# EAGLE board Printplaat version 2 with booting problems (EAGLE 9.7.0)
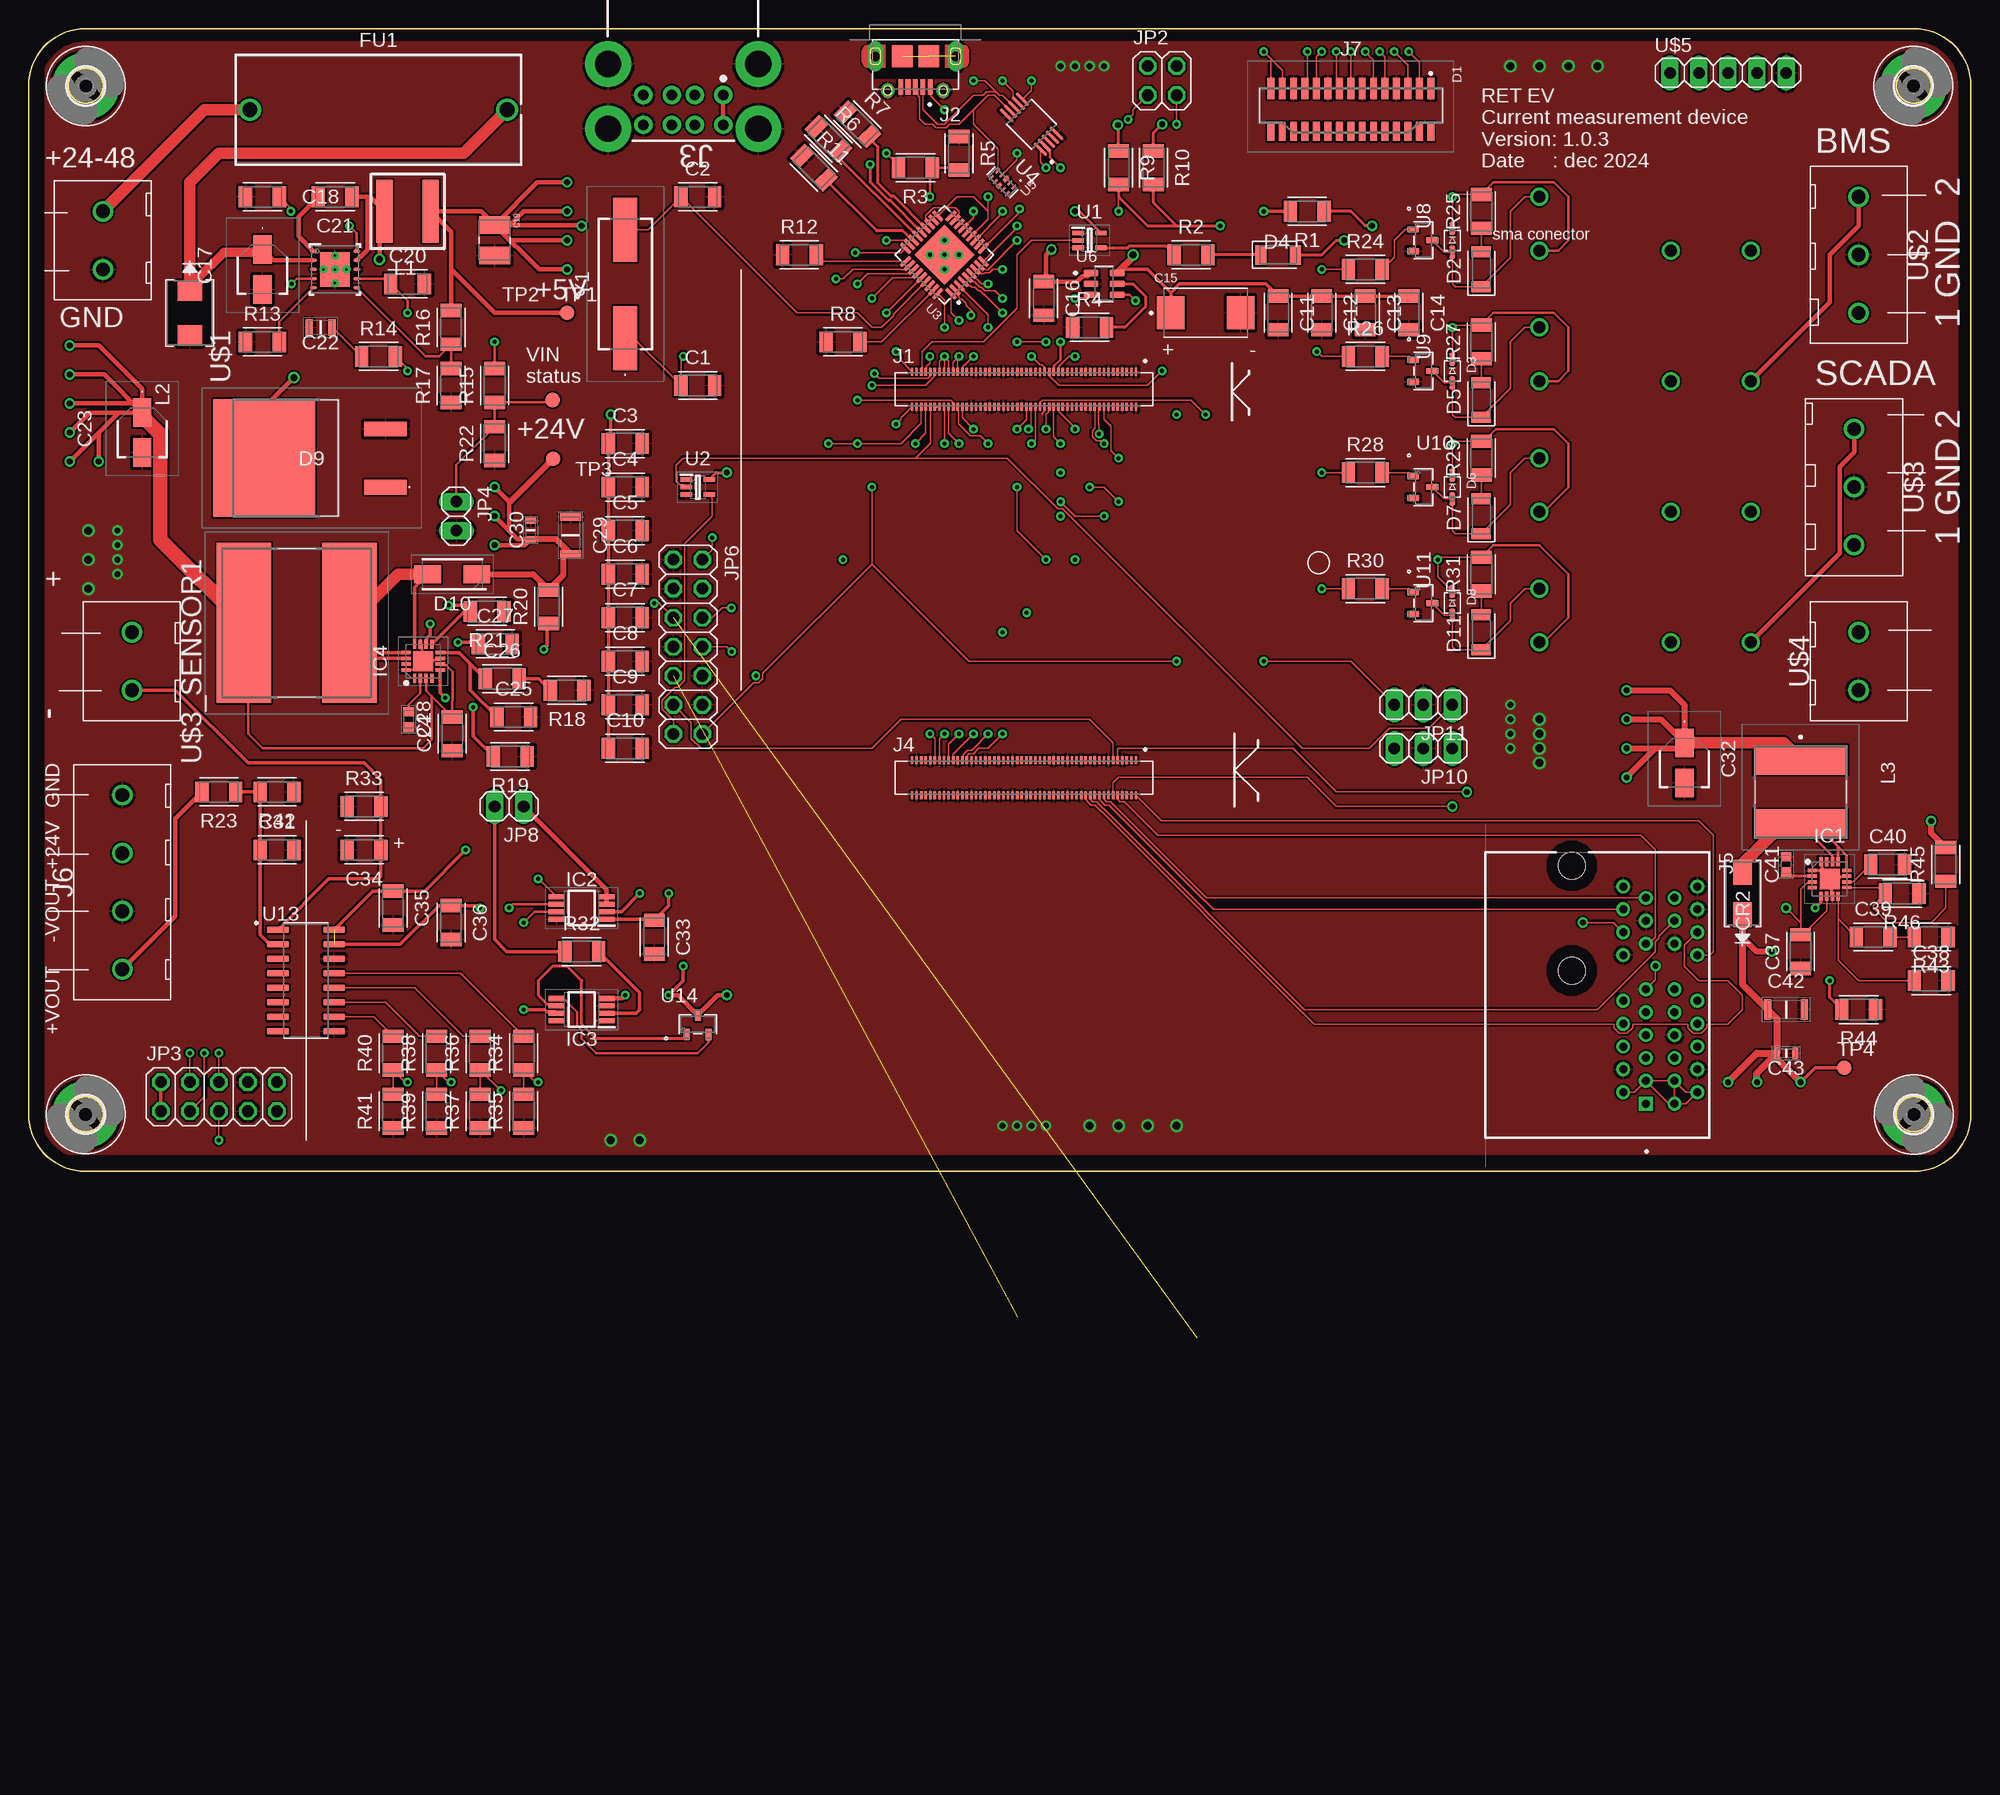
[diagram p7: board, top side]
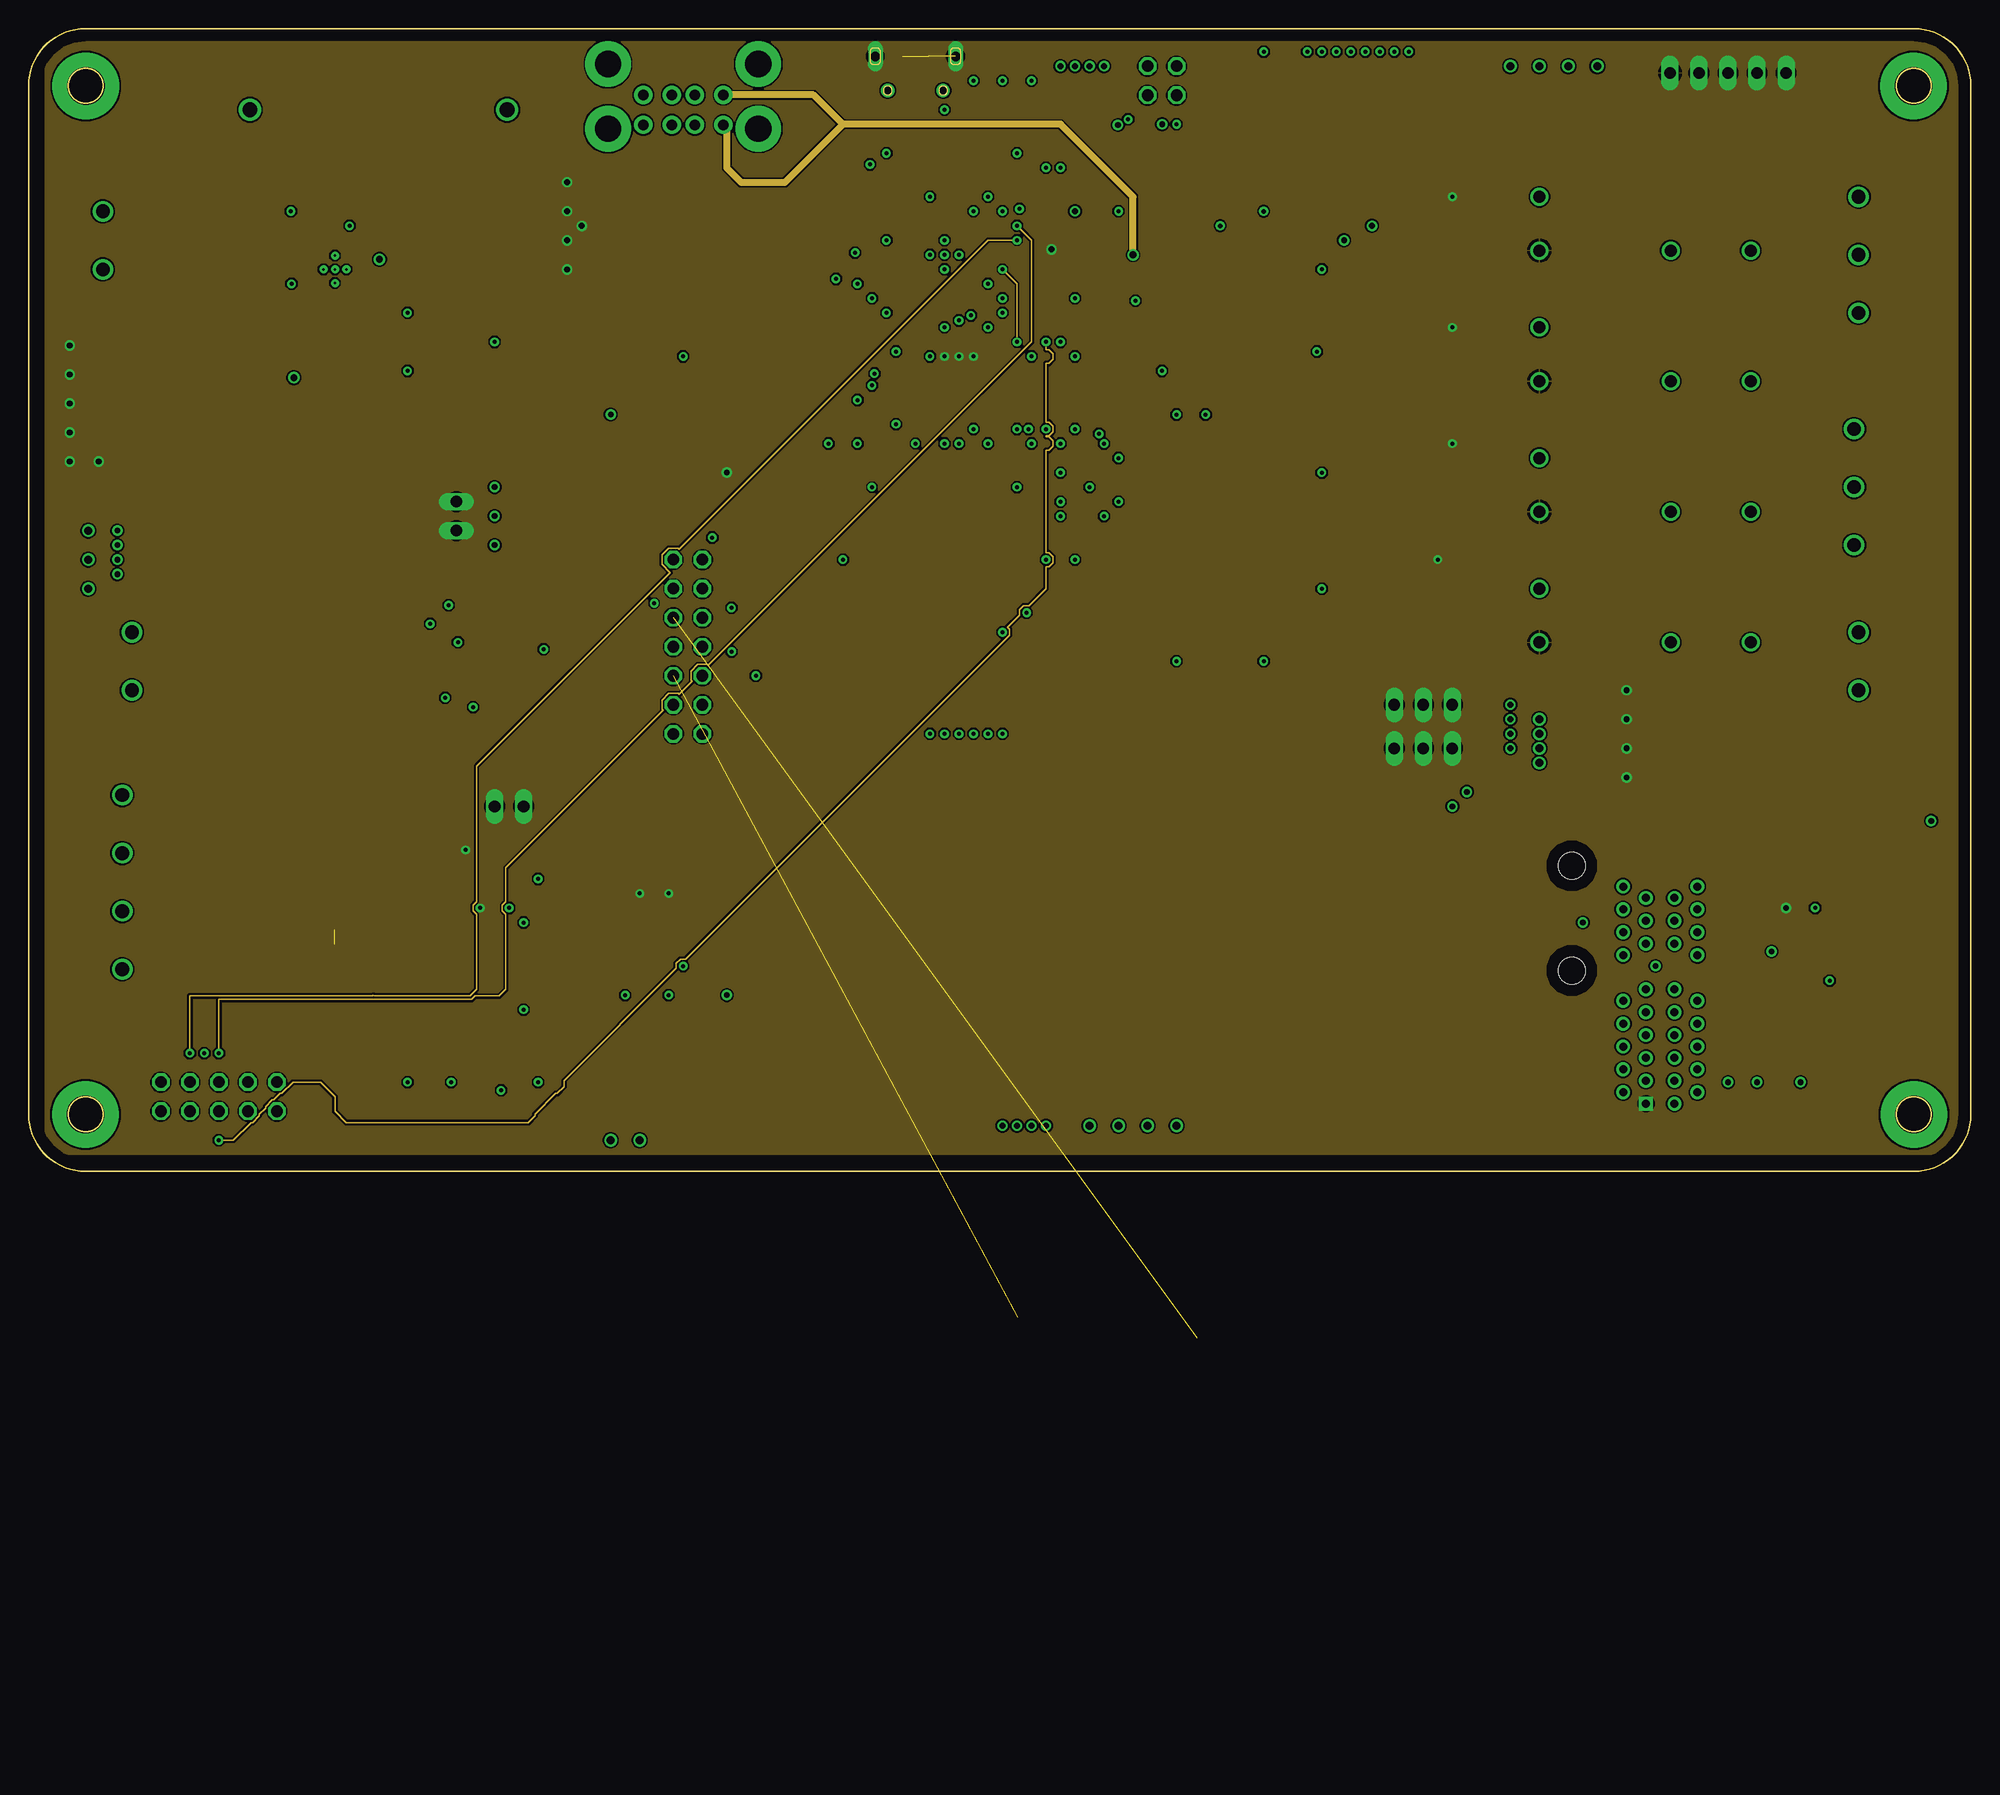
[diagram p8: board, inner layer Route2]
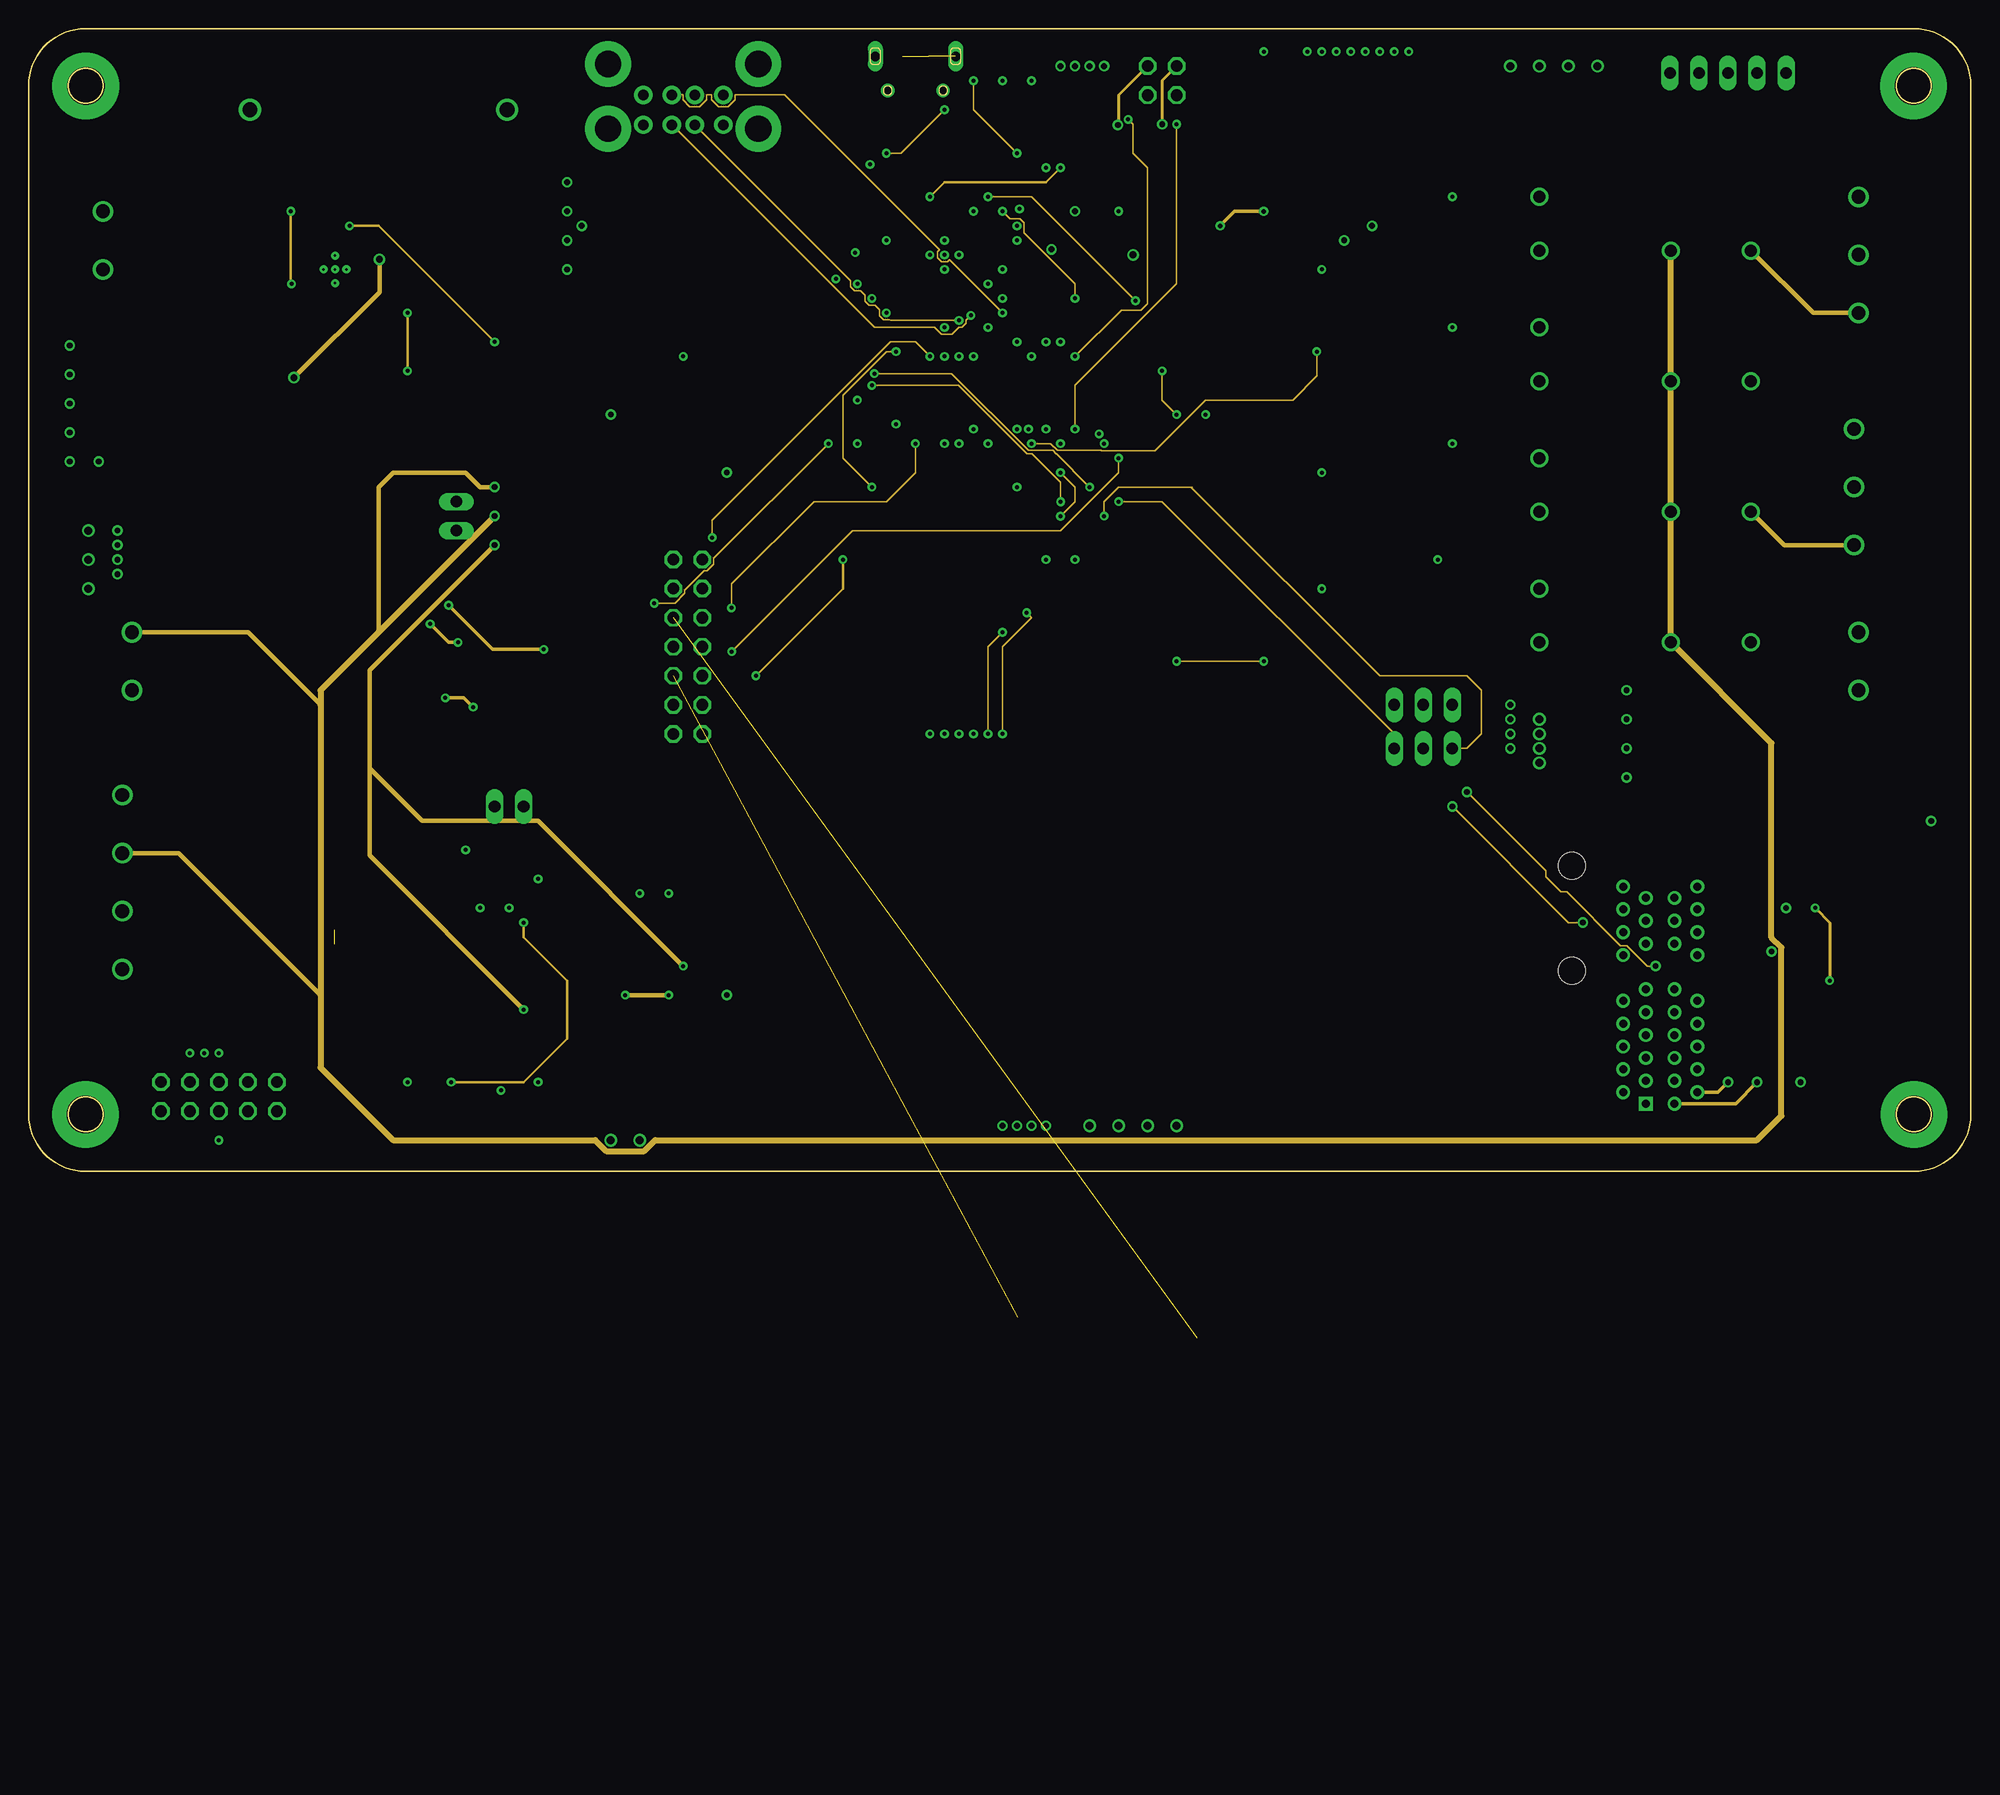
[diagram p9: board, inner layer Route3]
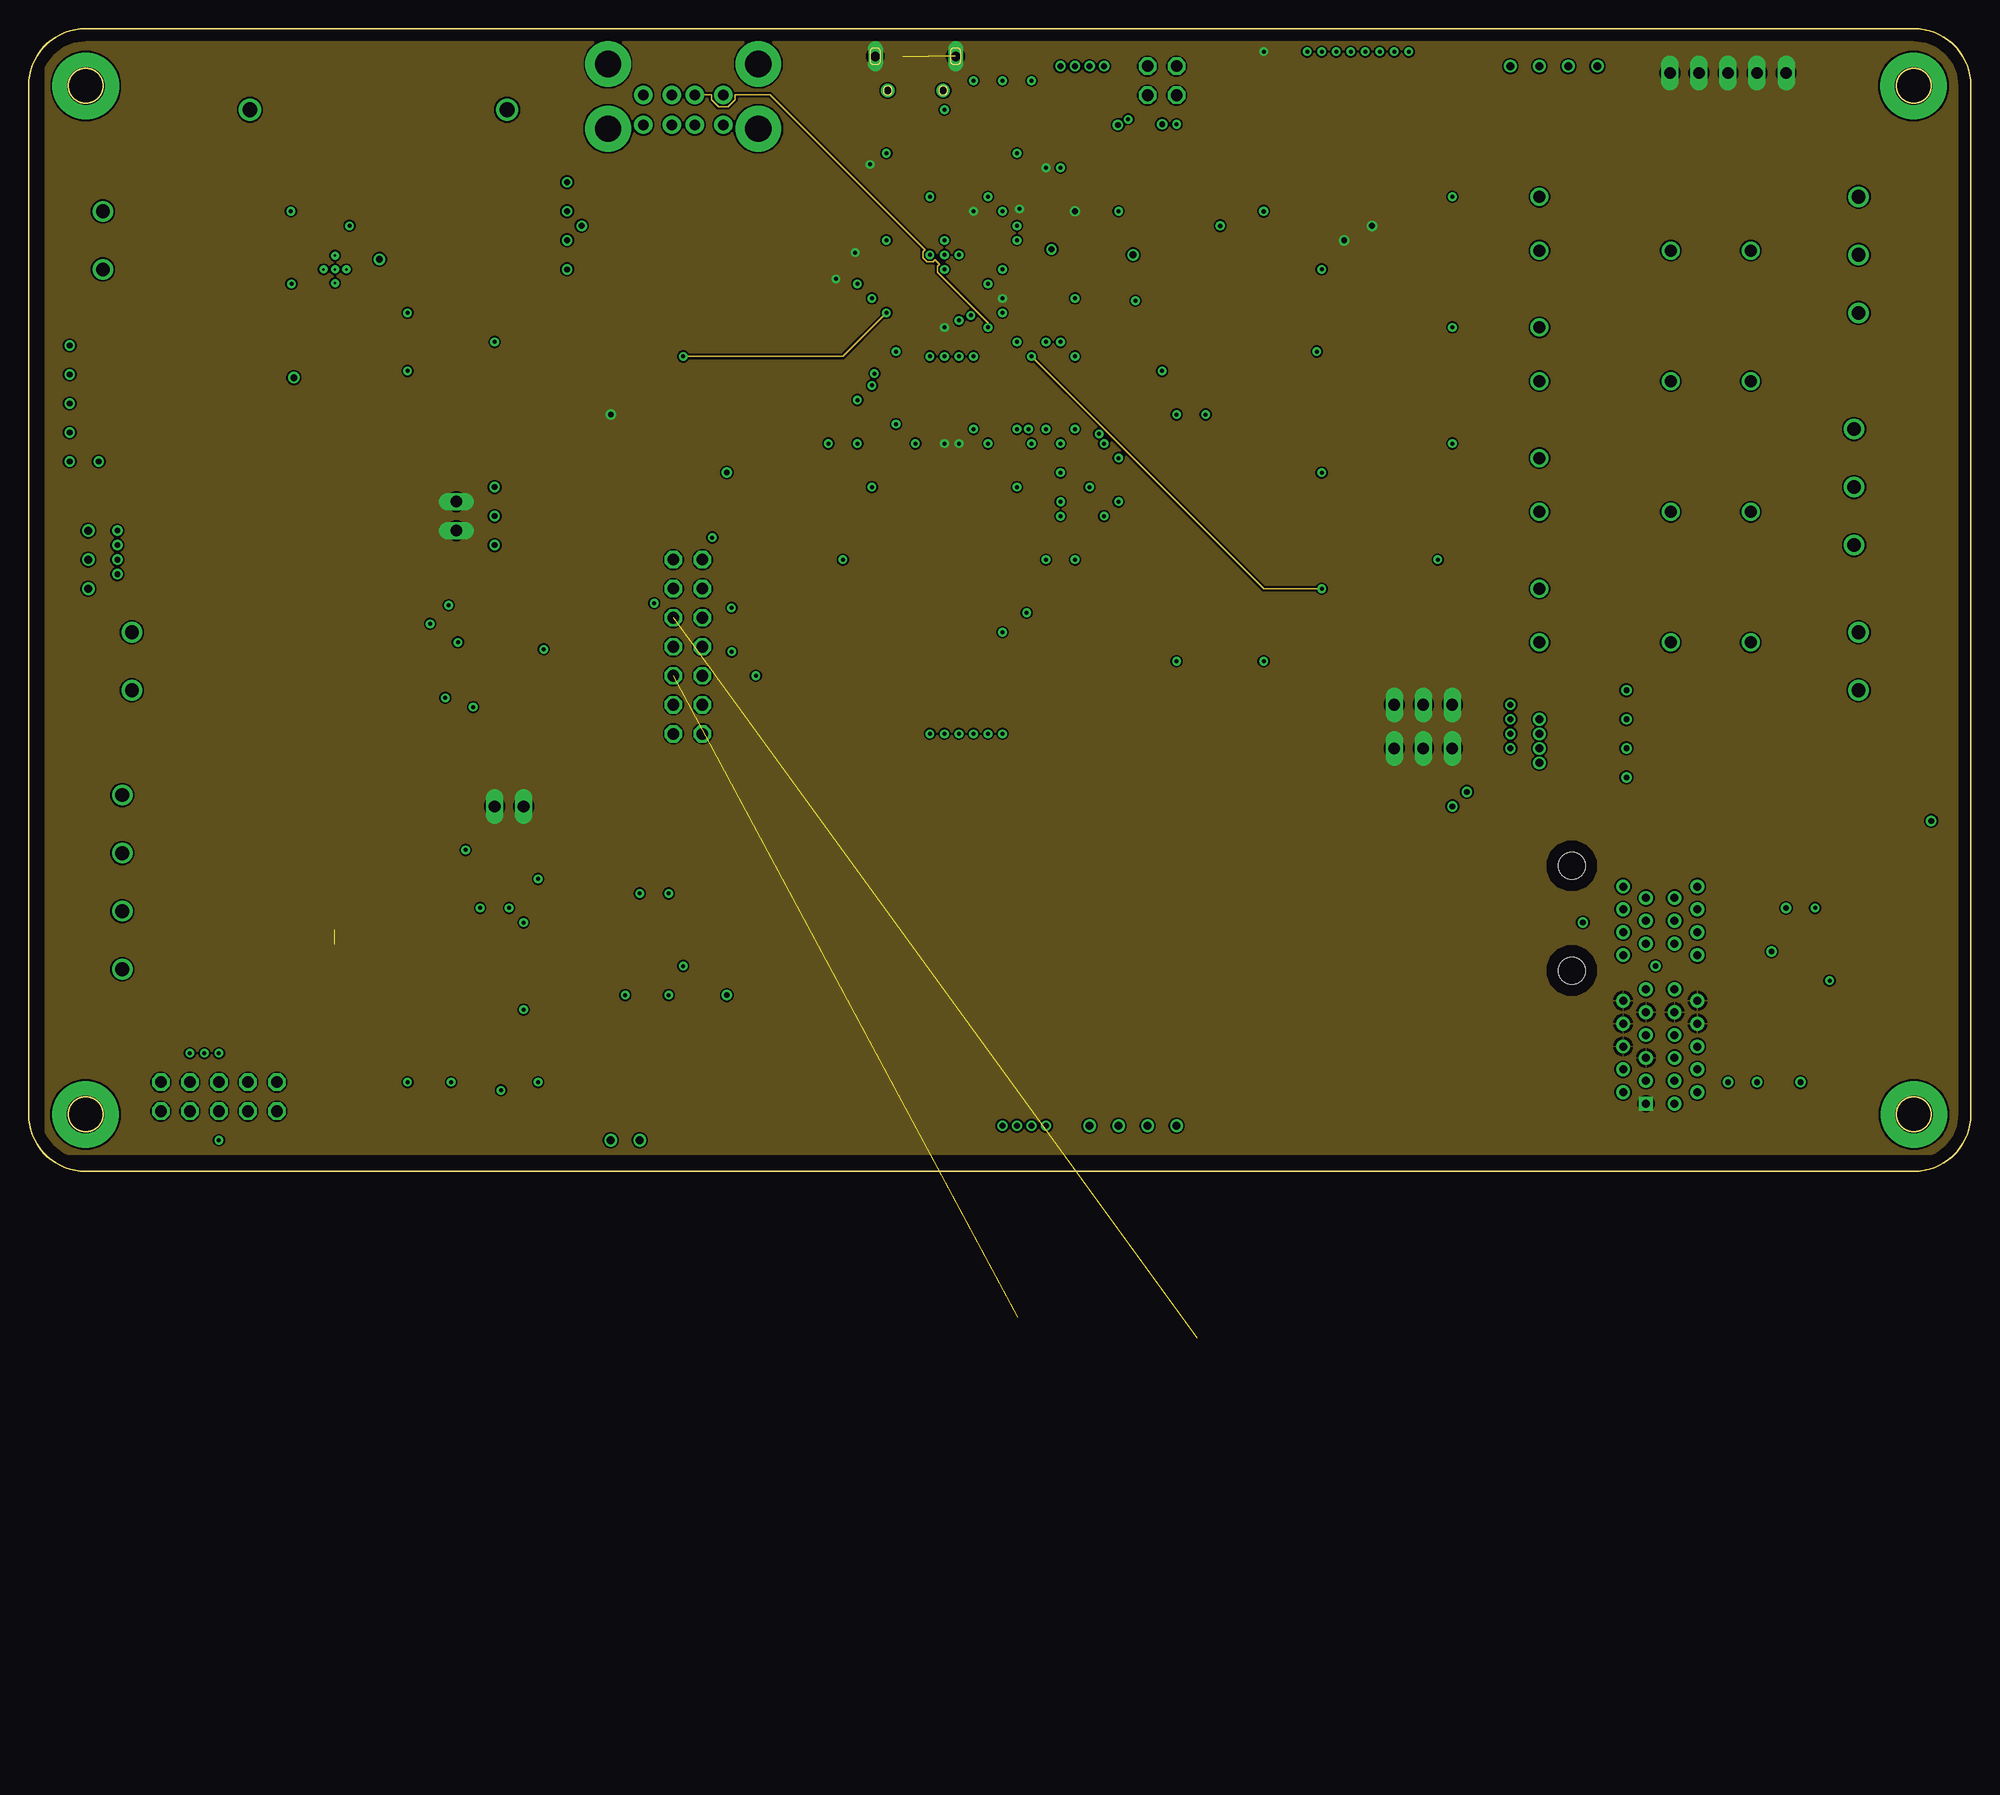
[diagram p10: board, inner layer Route4]
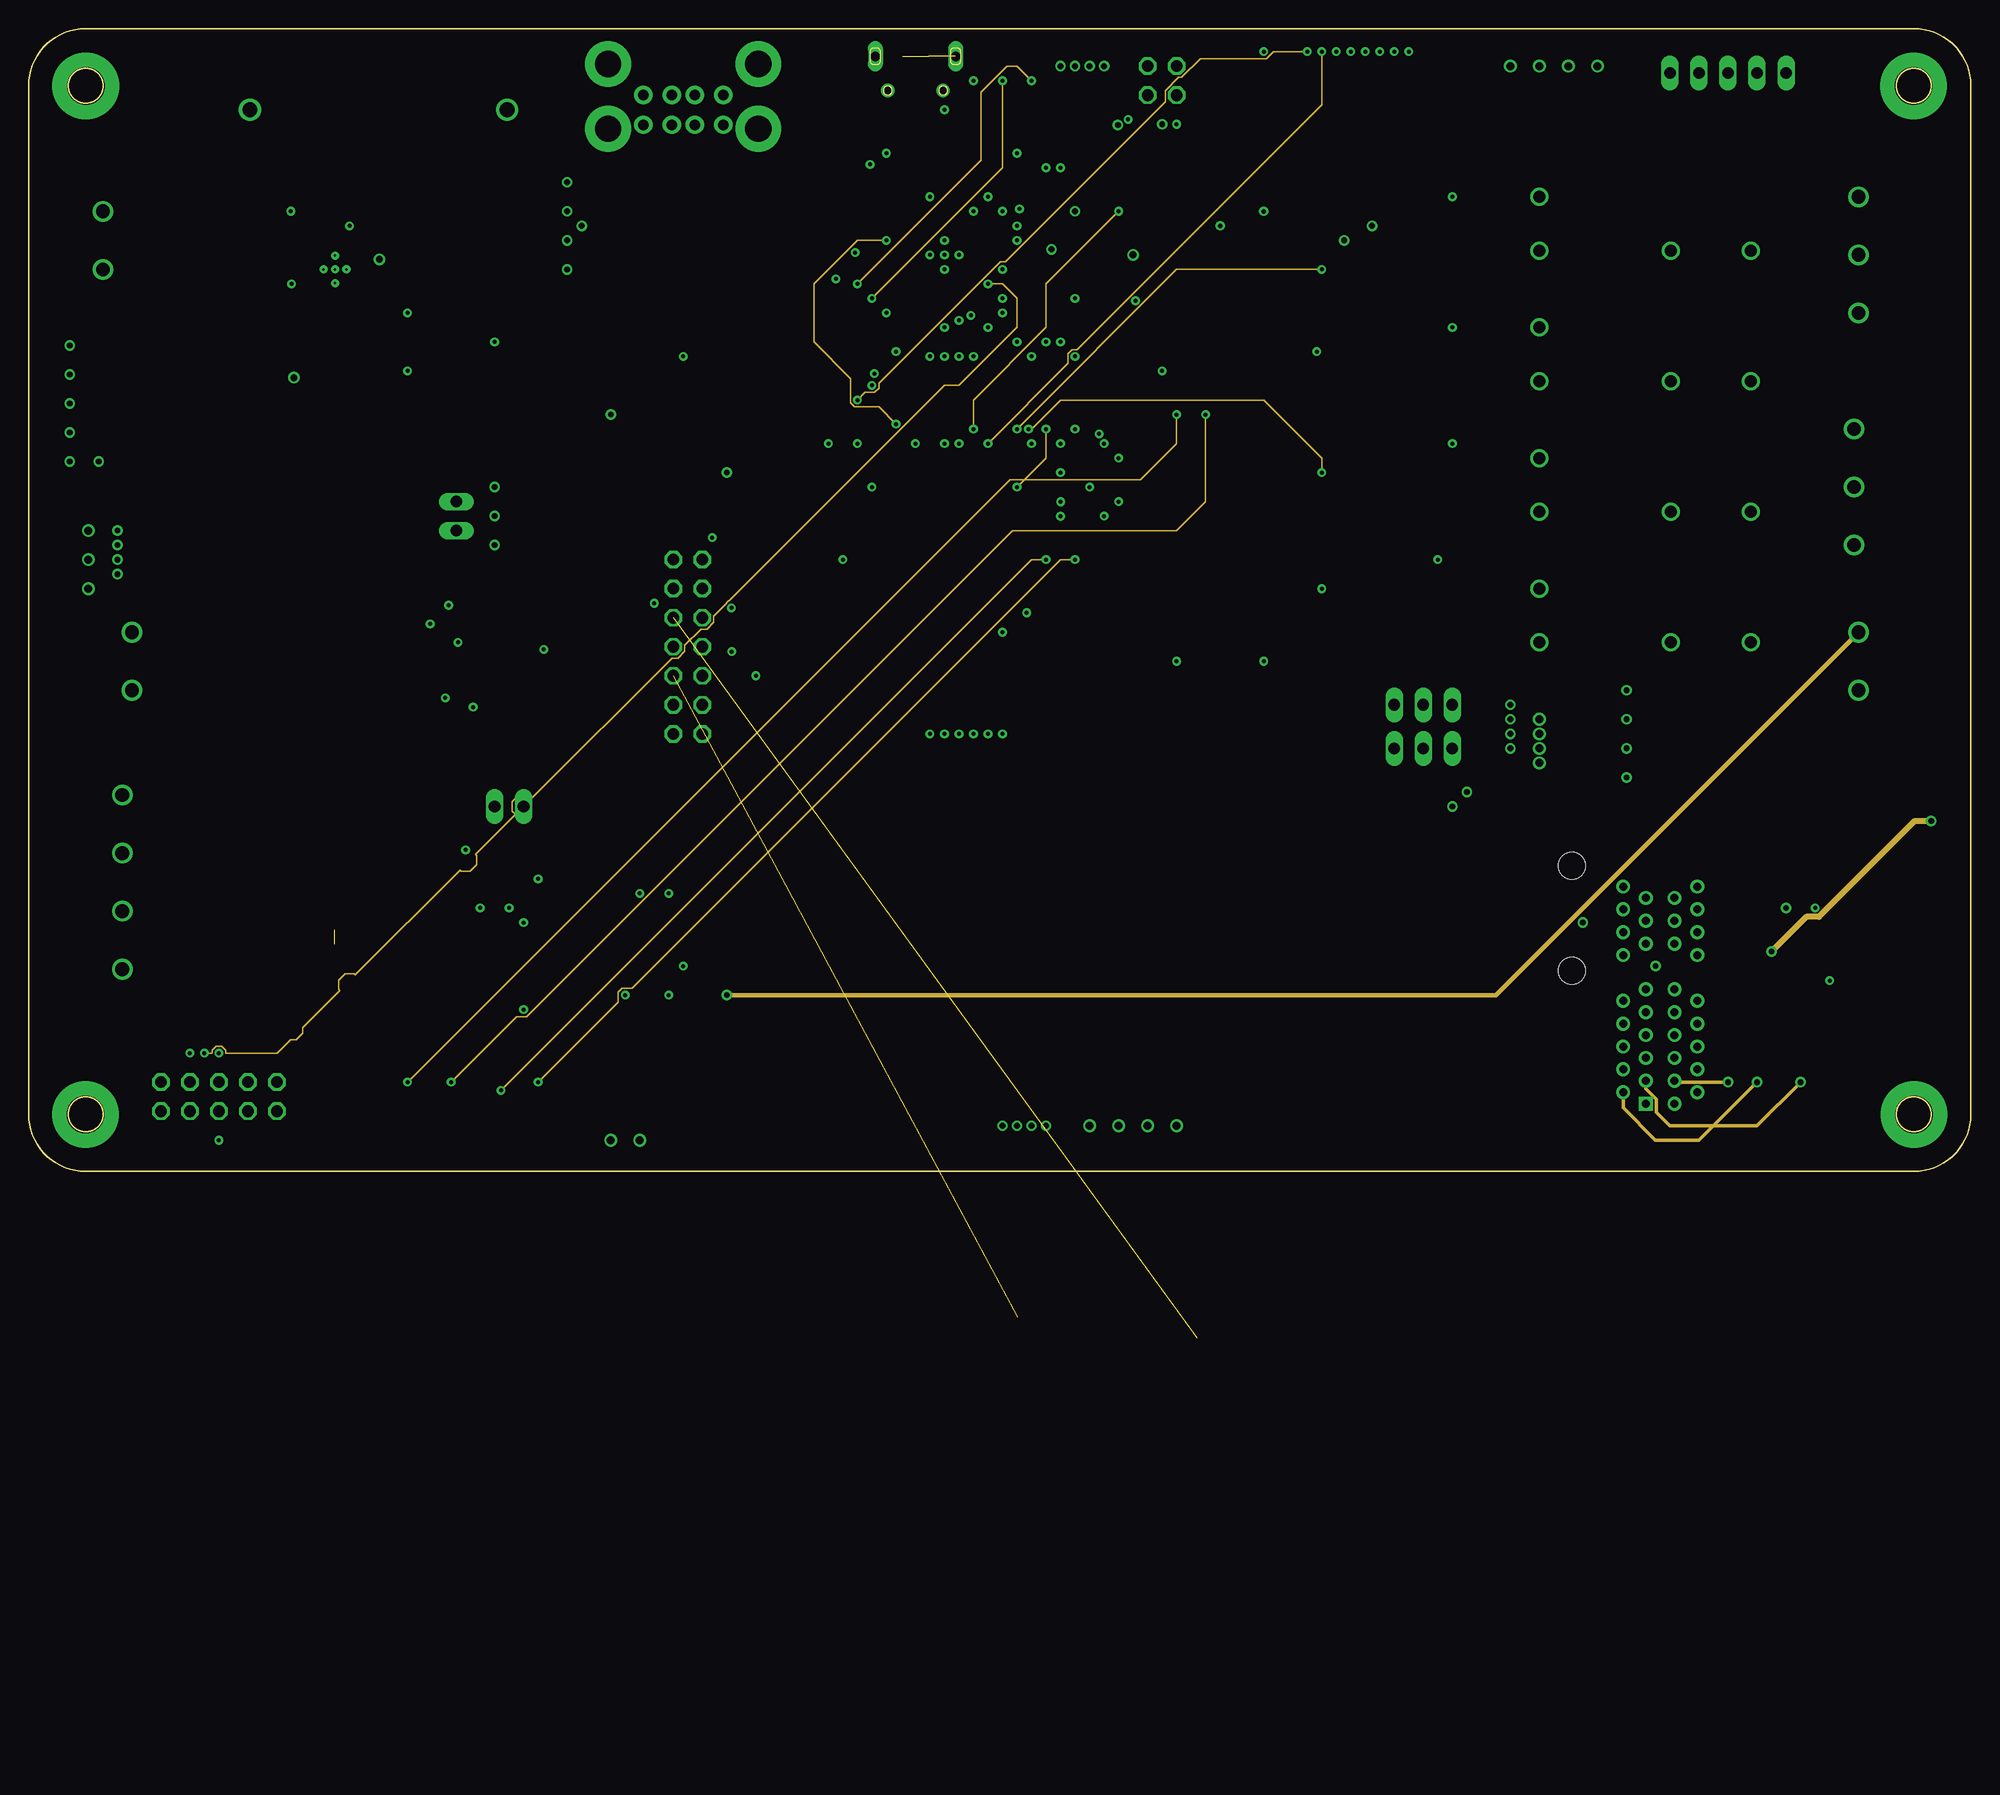
[diagram p11: board, inner layer Route13]
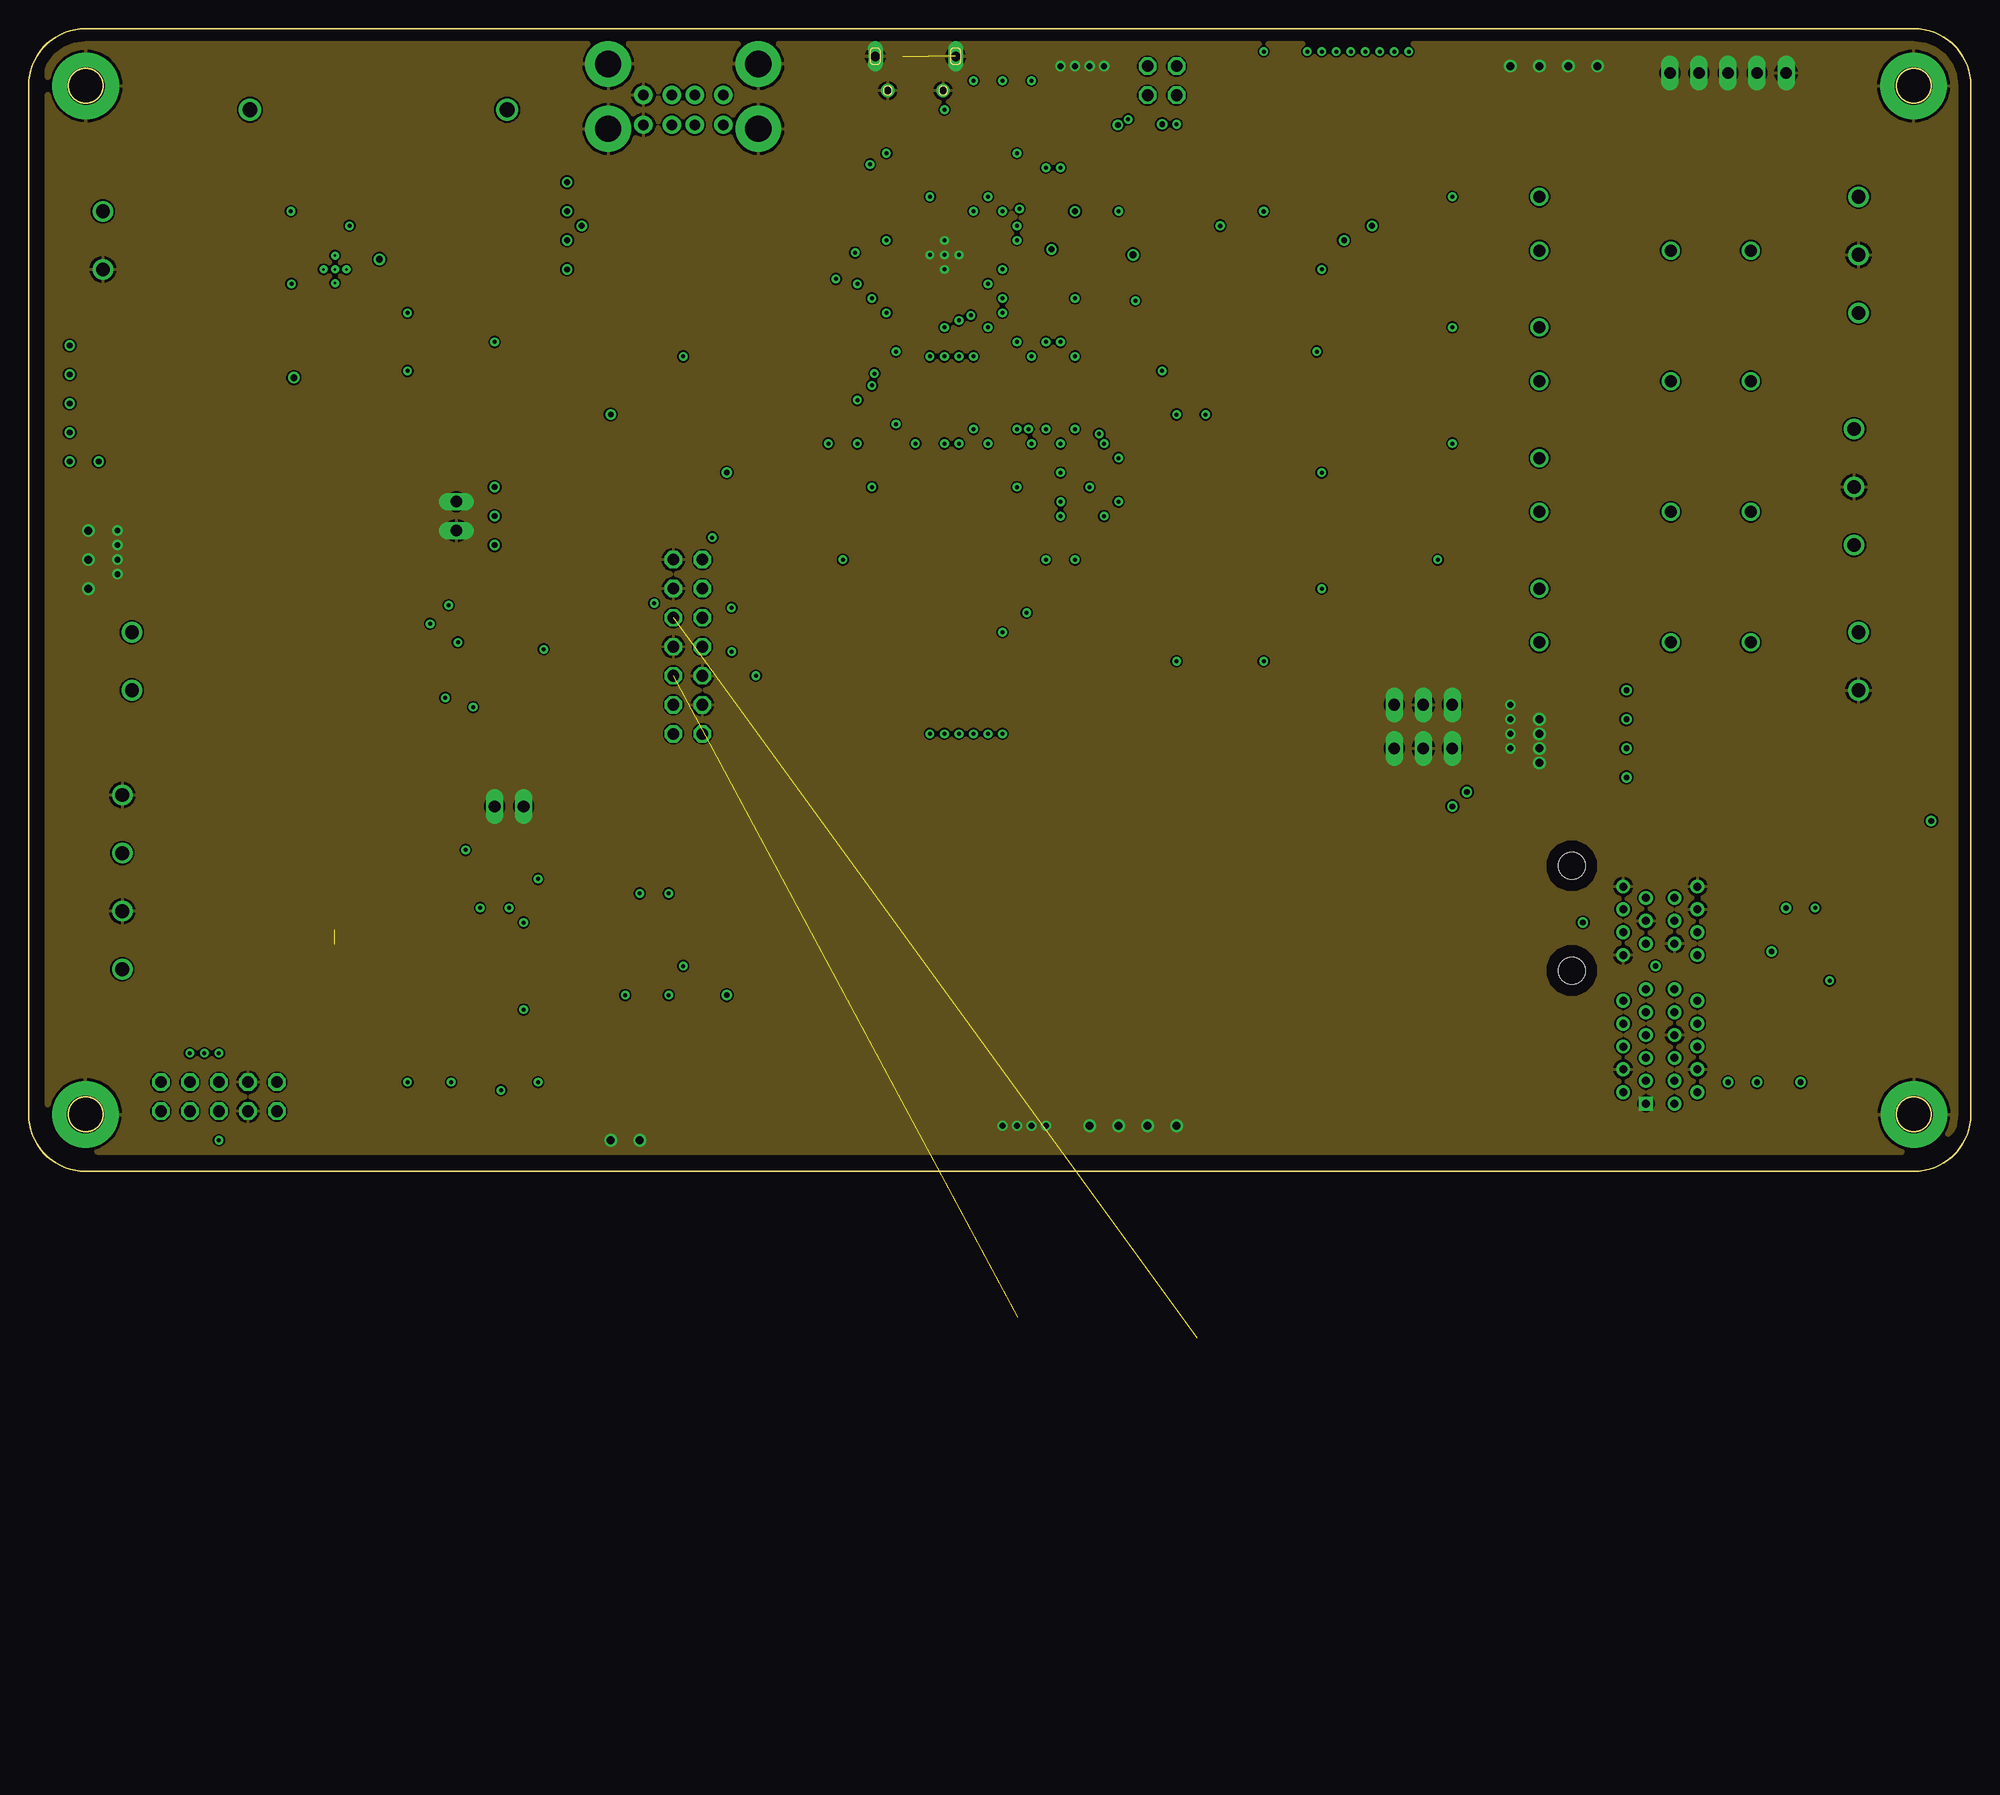
[diagram p12: board, inner layer Route14]
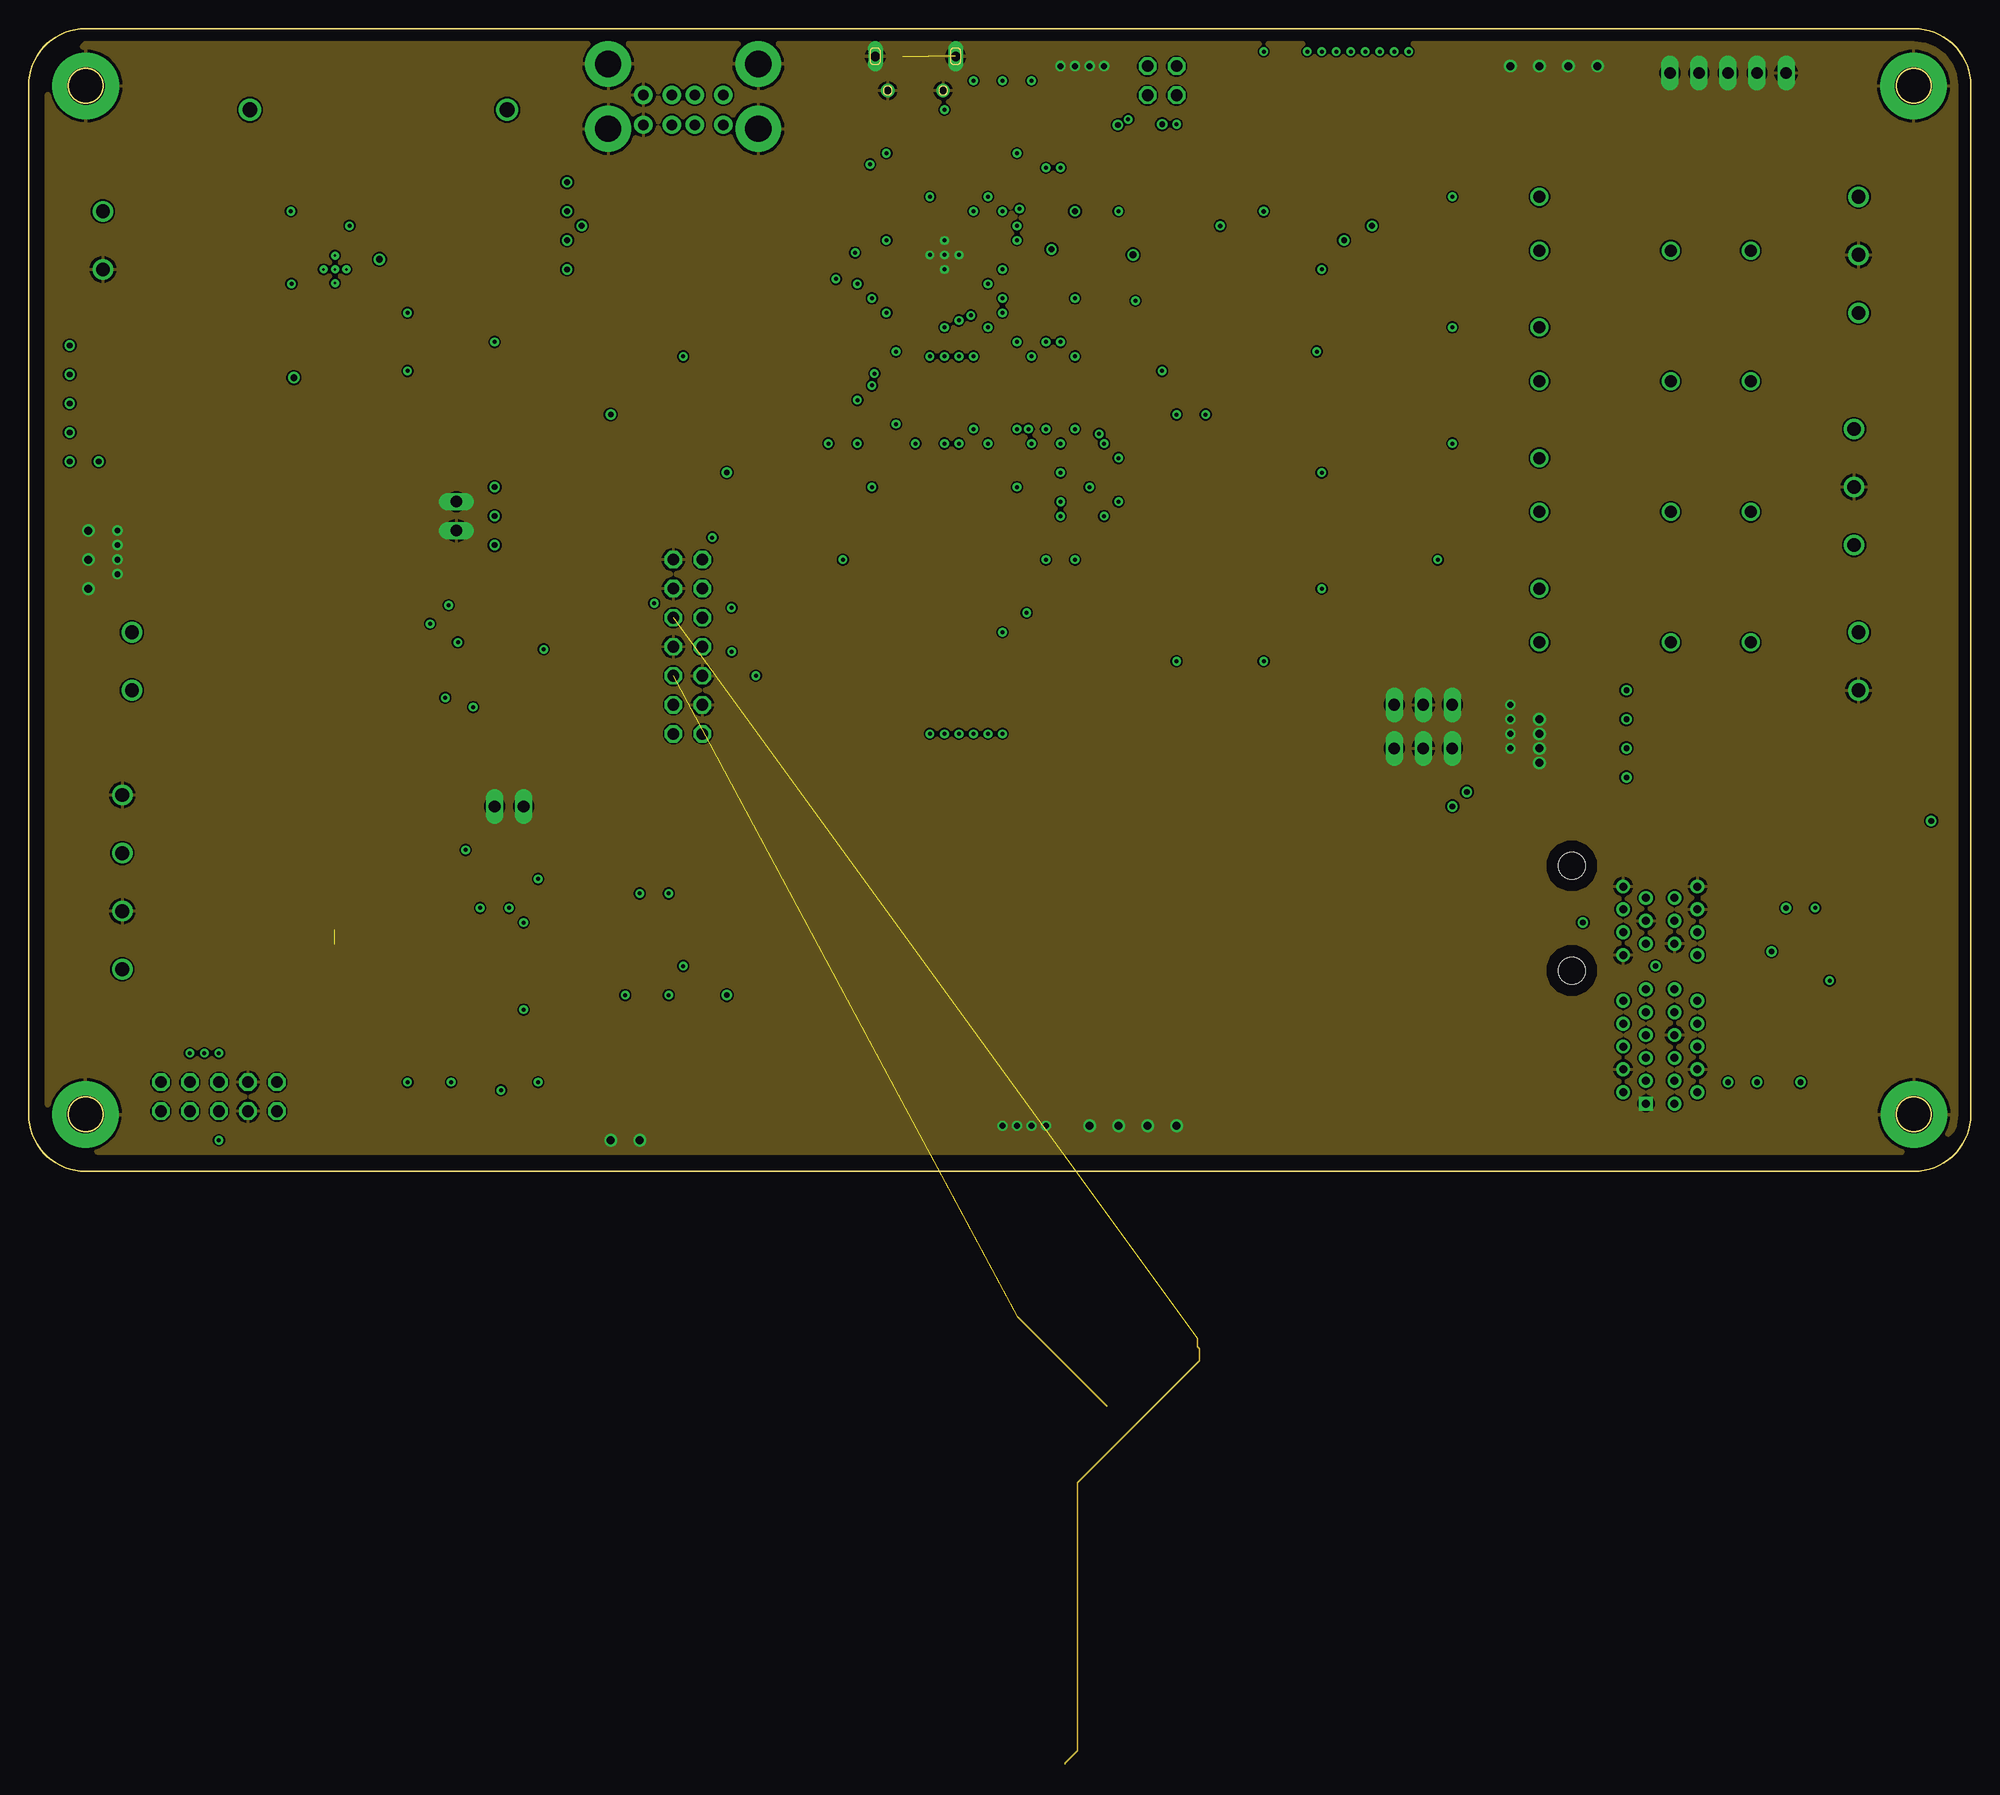
[diagram p13: board, inner layer Route15]
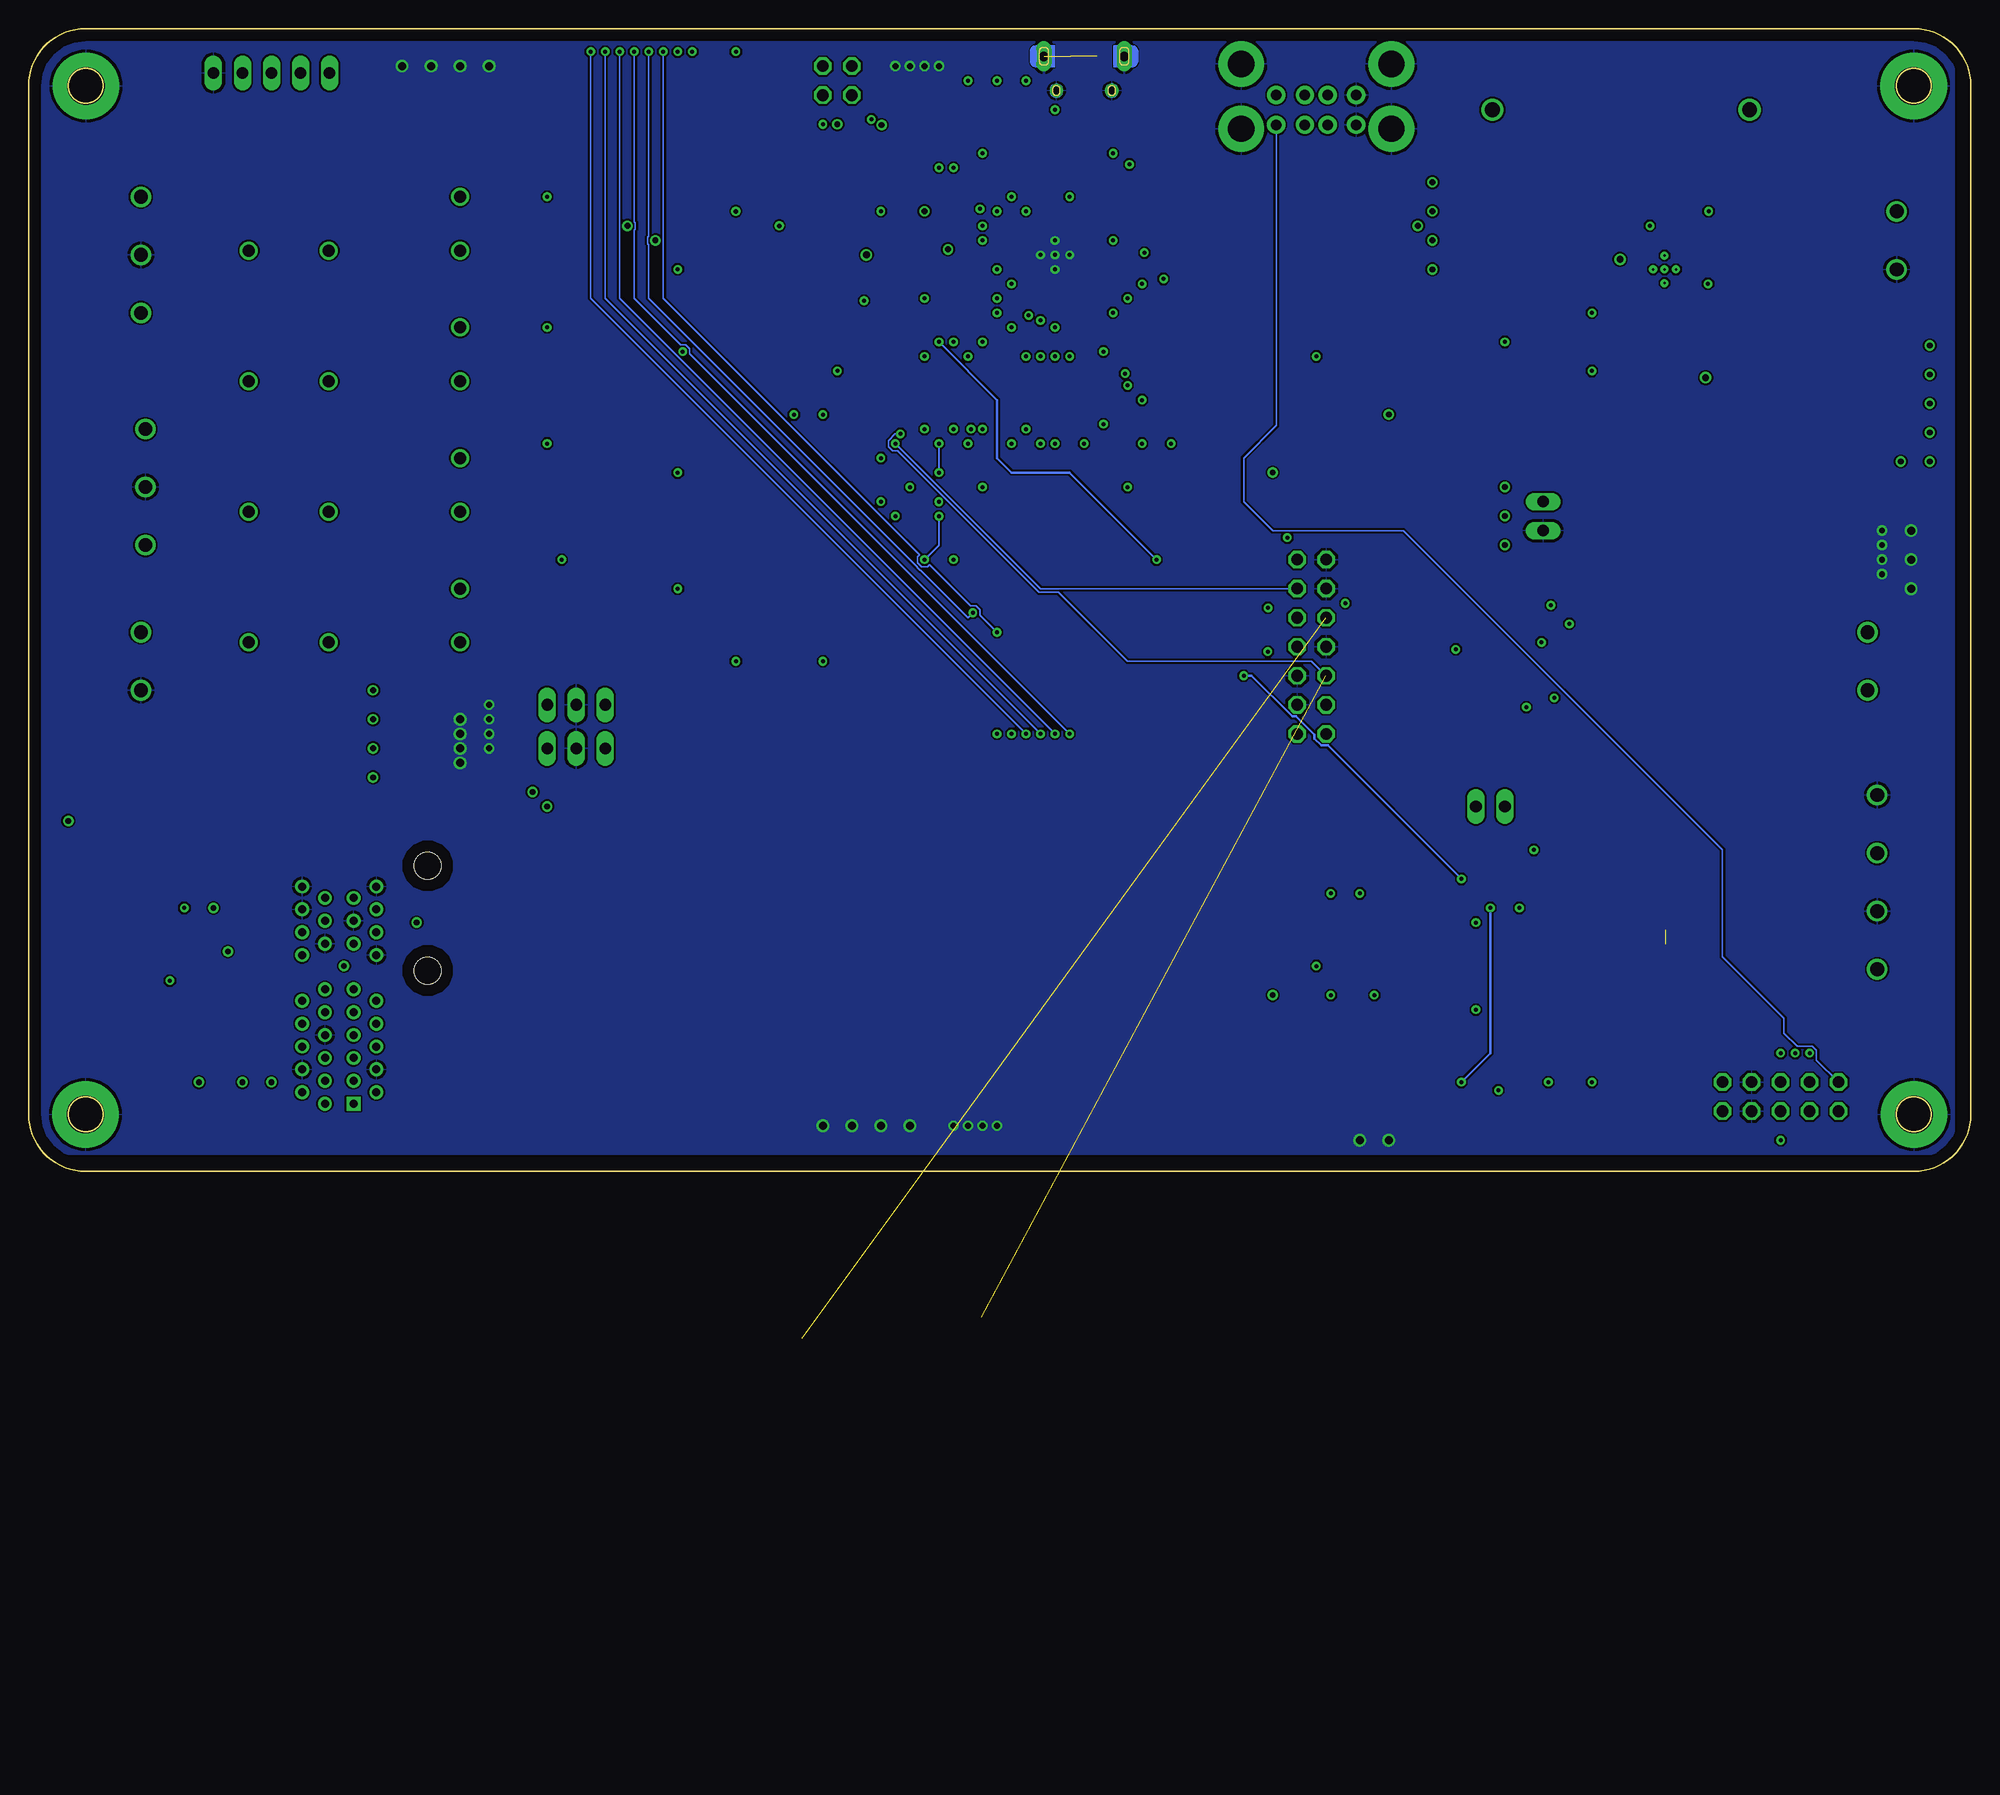
[diagram p14: board, bottom side, seen from below]

Size 170 x 100 mm. Coordinates in mm from the lower left corner, seen from the top.
Outline: 170,5 170,95 arc90 165,100 5,100 arc90 0,95 0,5 arc90 5,0 165,0 arc90 170,5
Outline: circle at 5,5 radius 1.5
Outline: circle at 5,95 radius 1.5
Outline: circle at 165,5 radius 1.5
Outline: circle at 165,95 radius 1.5
Copper layers (1+2*3+4*13+14*15+16): Top / Route2 / Route3 / Route4 / Route13 / Route14 / Route15 / Bottom
Stack-up 8 Layer Stack: Top SilkScreen Epoxy Ink / Top SolderMask SR:Green 0.0254mm Dk 4.3 / Top Surface Finish Lead-Free 0.02mm / Top CuFoil:007 0.035mm / Dielectric-1 Prepreg:001 0.064mm / Dielectric-2 Prepreg:001 0.064mm / Route2 CuFoil:007 0.035mm / Dielectric-3 Core:077 0.457mm / Route3 CuFoil:007 0.035mm / Dielectric-4 Prepreg:001 0.064mm / Dielectric-5 Prepreg:001 0.064mm / Route4 CuFoil:007 0.035mm / Dielectric-6 Core:077 0.457mm / Route13 CuFoil:007 0.035mm / Dielectric-7 Prepreg:001 0.064mm / Dielectric-8 Prepreg:001 0.064mm / Route14 CuFoil:007 0.035mm / Dielectric-9 Core:077 0.457mm / Route15 CuFoil:007 0.035mm / Dielectric-10 Prepreg:001 0.064mm / Dielectric-11 Prepreg:001 0.064mm / Bottom CuFoil:007 0.035mm / Bottom Surface Finish Lead-Free 0.02mm / Bottom SolderMask SR:Green 0.0254mm Dk 4.3 / Bottom SilkScreen Epoxy Ink
Design rules: minimum copper width 6mil, minimum drill size 0.35mm, copper clearance wire_polygon to wire_polygon 6mil, copper clearance wire_polygon to pad_smd 6mil, copper clearance wire_polygon to via 6mil, copper clearance pad_smd to pad_smd 6mil, copper clearance pad_smd to via 6mil, copper clearance via to via 6mil, copper clearance smd to pad (same net) 6mil, copper clearance smd to via (same net) 6mil, copper clearance smd to smd (same net) 6mil, dimension clearance 40mil, via restrict clearance 0mil, restrict clearance 0mil, drill distance 6mil, keepout clearance 0mil

## Footprints (pad centres in the part's own frame; a part is rotated, then mirrored left to right if it is on the bottom)
CAPC3216X135 = smd 1.165 x 1.815: 1 -1.475,0; 2 1.475,0
CAP_20TDC100MYF = smd 2.4 x 2.9: 1 -3.05,0; 2 3.05,0
EEE1AA220WR = smd 2.5 x 1.6: 1 -1.75,0; 2 1.75,0
CAPC3225X270N = smd 1.53 x 2.72: 1 -1.341,0; 2 1.341,0
CAPC2012X75N = smd 0.62 x 1.47: 1 -1,0; 2 1,0
CAPC1608X90N = smd 0.81 x 0.94: 1 -0.67,0; 2 0.67,0
CAPC3216X180N = smd 0.62 x 1.82: 1 -1.6,0; 2 1.6,0
CAPC1608X90N' = smd 0.54 x 0.94: 1 -0.8,0; 2 0.8,0
SMBJSERIES_LTF-L = smd 1.803 x 2.134: 1 -1.968,0; 2 1.968,0
SMA_DIO = smd 2.18 x 1.63: 1 -1.857,0; 2 1.857,0
SOD-323 = smd 1.14 x 0.52: A 1.04,0; C -1.04,0
LEDC3216X75N_FLAT-R = smd 0.962 x 1.712: A 1.525,0; C -1.525,0
T1210T8G = smd 3.7 x 1.3: 1 13.3,-2.54; 3 13.3,2.54 | smd 8.9 x 10.3: 2 2.7,0
DIOM5226X230N = smd 2.35 x 1.55: 1 -2.15,0; 2 2.15,0
696103201002 = drill 1.3: 1 -11.25,0; 2 11.25,0
3,3-PAD = drill 3.3 pad 5.842: B3,3 0,0
QFN50P300X300X80-17N = smd 0.8 x 0.3: 1 -1.5,0.75; 2 -1.5,0.25; 3 -1.5,-0.25; 4 -1.5,-0.75; 9 1.5,-0.75; 10 1.5,-0.25; 11 1.5,0.25; 12 1.5,0.75 | smd 0.3 x 0.8: 5 -0.75,-1.5; 6 -0.25,-1.5; 7 0.25,-1.5; 8 0.75,-1.5; 13 0.75,1.5; 14 0.25,1.5; 15 -0.25,1.5; 16 -0.75,1.5 | smd 1.76 x 1.76: 17 0,0
SOP65P490X110-8N = smd 1.4 x 0.45: 1 -2.2,0.975; 2 -2.2,0.325; 3 -2.2,-0.325; 4 -2.2,-0.975; 5 2.2,-0.975; 6 2.2,-0.325; 7 2.2,0.325; 8 2.2,0.975
HIROSE_DF40C-100DS-0.4V(51) = smd 0.2 x 0.7: 1 9.8,1.54; 2 9.8,-1.54; 3 9.4,1.54; 4 9.4,-1.54; 5 9,1.54; 6 9,-1.54; 7 8.6,1.54; 8 8.6,-1.54; 9 8.2,1.54; 10 8.2,-1.54; 11 7.8,1.54; 12 7.8,-1.54; 13 7.4,1.54; 14 7.4,-1.54; 15 7,1.54; 16 7,-1.54; 17 6.6,1.54; 18 6.6,-1.54; 19 6.2,1.54; 20 6.2,-1.54; 21 5.8,1.54; 22 5.8,-1.54; 23 5.4,1.54; 24 5.4,-1.54; 25 5,1.54; 26 5,-1.54; 27 4.6,1.54; 28 4.6,-1.54; 29 4.2,1.54; 30 4.2,-1.54; 31 3.8,1.54; 32 3.8,-1.54; 33 3.4,1.54; 34 3.4,-1.54; 35 3,1.54; 36 3,-1.54; 37 2.6,1.54; 38 2.6,-1.54; 39 2.2,1.54; 40 2.2,-1.54; 41 1.8,1.54; 42 1.8,-1.54; 43 1.4,1.54; 44 1.4,-1.54; 45 1,1.54; 46 1,-1.54; 47 0.6,1.54; 48 0.6,-1.54; 49 0.2,1.54; 50 0.2,-1.54; 51 -0.2,1.54; 52 -0.2,-1.54; 53 -0.6,1.54; 54 -0.6,-1.54; 55 -1,1.54; 56 -1,-1.54; 57 -1.4,1.54; 58 -1.4,-1.54; 59 -1.8,1.54; 60 -1.8,-1.54; 61 -2.2,1.54; 62 -2.2,-1.54; 63 -2.6,1.54; 64 -2.6,-1.54; 65 -3,1.54; 66 -3,-1.54; 67 -3.4,1.54; 68 -3.4,-1.54; 69 -3.8,1.54; 70 -3.8,-1.54; 71 -4.2,1.54; 72 -4.2,-1.54; 73 -4.6,1.54; 74 -4.6,-1.54; 75 -5,1.54; 76 -5,-1.54; 77 -5.4,1.54; 78 -5.4,-1.54; 79 -5.8,1.54; 80 -5.8,-1.54; 81 -6.2,1.54; 82 -6.2,-1.54; 83 -6.6,1.54; 84 -6.6,-1.54; 85 -7,1.54; 86 -7,-1.54; 87 -7.4,1.54; 88 -7.4,-1.54; 89 -7.8,1.54; 90 -7.8,-1.54; 91 -8.2,1.54; 92 -8.2,-1.54; 93 -8.6,1.54; 94 -8.6,-1.54; 95 -9,1.54; 96 -9,-1.54; 97 -9.4,1.54; 98 -9.4,-1.54; 99 -9.8,1.54; 100 -9.8,-1.54
HRS_ZX62D-B-5P8 = smd 0.4 x 1.35: 1 -1.3,2.6; 2 -0.65,2.6; 3 0,2.6; 4 0.65,2.6; 5 1.3,2.6 | drill 0.65 pad 1.05: S1 -2.425,2.925; S2 2.425,2.925 | drill 0.825 pad 0.95 long: S3 -3.513,-0.075; S6 3.513,-0.075 | smd 1.8 x 1.9: S4 -1.15,-0.075; S5 1.15,-0.075
GCT_USB1035-XX-X-X-X-B_REVE = drill 0.92 pad 1.6: 1A -3.5,5.33; 1B -3.5,2.71; 2A -1,5.33; 2B -1,2.71; 3A 1,5.33; 3B 1,2.71; 4A 3.5,5.33; 4B 3.5,2.71 | drill 2.3 pad 4: 9 -6.57,0; 10 6.57,0; 11 -6.57,5.68; 12 6.57,5.68
SAMTEC_PCIE-036-02-X-D-RA = drill 0.7 square: A01 9.5,4.25 | drill 0.7: A02 8.5,2.25; A03 7.5,4.25; A04 6.5,2.25; A05 5.5,4.25; A06 4.5,2.25; A07 3.5,4.25; A08 2.5,2.25; A09 1.5,4.25; A10 0.5,2.25; A11 -0.5,4.25; A12 -3.5,2.25; A13 -4.5,4.25; A14 -5.5,2.25; A15 -6.5,4.25; A16 -7.5,2.25; A17 -8.5,4.25; A18 -9.5,2.25; B01 9.5,6.75; B02 8.5,8.75; B03 7.5,6.75; B04 6.5,8.75; B05 5.5,6.75; B06 4.5,8.75; B07 3.5,6.75; B08 2.5,8.75; B09 1.5,6.75; B10 0.5,8.75; B11 -0.5,6.75; B12 -3.5,8.75; B13 -4.5,6.75; B14 -5.5,8.75; B15 -6.5,6.75; B16 -7.5,8.75; B17 -8.5,6.75; B18 -9.5,8.75 | hole 2.35: -2.15,-2.25; -11.3,-2.25
TERMBLK_508-4N = drill 1.2: 1 0,0; 2 5.08,0; 3 10.16,0; 4 15.24,0
117342485 = smd 0.6 x 1.85: 1 7,-0.025; 2 6,-0.025; 3 5,-0.025; 4 4,-0.025; 5 3,-0.025; 6 2,-0.025; 7 1,-0.025; 8 0,-0.025; 9 -1,-0.025; 10 -2,-0.025; 11 -3,-0.025; 12 -4,-0.025; 13 -5,-0.025; 14 -6,-0.025; 15 -7,-0.025 | smd 0.6 x 1.65: 16 7,-3.775; 17 6,-3.775; 18 5,-3.775; 19 4,-3.775; 20 3,-3.775; 21 2,-3.775; 22 1,-3.775; 23 0,-3.775; 24 -1,-3.775; 25 -2,-3.775; 26 -3,-3.775; 27 -4,-3.775; 28 -5,-3.775; 29 -6,-3.775; 30 -7,-3.775
2X02 = drill 1.016 octagon: 1 -1.27,-1.27; 2 -1.27,1.27; 3 1.27,-1.27; 4 1.27,1.27
2X05 = drill 1.016 octagon: 1 -5.08,-1.27; 2 -5.08,1.27; 3 -2.54,-1.27; 4 -2.54,1.27; 5 0,-1.27; 6 0,1.27; 7 2.54,-1.27; 8 2.54,1.27; 9 5.08,-1.27; 10 5.08,1.27
1X02 = drill 1.016 long: 1 -1.27,0; 2 1.27,0
2X07 = drill 1.016 octagon: 1 -7.62,-1.27; 2 -7.62,1.27; 3 -5.08,-1.27; 4 -5.08,1.27; 5 -2.54,-1.27; 6 -2.54,1.27; 7 0,-1.27; 8 0,1.27; 9 2.54,-1.27; 10 2.54,1.27; 11 5.08,-1.27; 12 5.08,1.27; 13 7.62,-1.27; 14 7.62,1.27
1X03 = drill 1.016 long: 1 -2.54,0; 2 0,0; 3 2.54,0
XAL6060-103MEB = smd 1.43 x 5.5: 1 -2.02,0; 2 2.02,0
SDR1307270ML = smd 14 x 4.75: 1 0,-4.625; 2 0,4.625
SRN80408R2Y = smd 2.6 x 8.2: 1 -2.8,0; 2 2.8,0
RESC3216X70 = smd 1.165 x 1.815: 1 -1.475,0; 2 1.475,0
ZETTLER_5V_RELAY = drill 1.05: COIL+ 0,-4.7; COIL- 0,0; IN 11.5,-4.7; OUT 18.5,-4.7
B1,27 = smd 1.27 x 1.27: TP 0,0
SOT65P210X110-5N = smd 1 x 0.4: 1 -1,0.65; 2 -1,0; 3 -1,-0.65; 4 1,-0.65; 5 1,0.65
QFN50P600X600X100-37N = smd 1.1 x 0.26: 1 -2.815,2; 2 -2.815,1.5; 3 -2.815,1; 4 -2.815,0.5; 5 -2.815,0; 6 -2.815,-0.5; 7 -2.815,-1; 8 -2.815,-1.5; 9 -2.815,-2; 19 2.815,-2; 20 2.815,-1.5; 21 2.815,-1; 22 2.815,-0.5; 23 2.815,0; 24 2.815,0.5; 25 2.815,1; 26 2.815,1.5; 27 2.815,2 | smd 0.26 x 1.1: 10 -2,-2.815; 11 -1.5,-2.815; 12 -1,-2.815; 13 -0.5,-2.815; 14 0,-2.815; 15 0.5,-2.815; 16 1,-2.815; 17 1.5,-2.815; 18 2,-2.815; 28 2,2.815; 29 1.5,2.815; 30 1,2.815; 31 0.5,2.815; 32 0,2.815; 33 -0.5,2.815; 34 -1,2.815; 35 -1.5,2.815; 36 -2,2.815 | smd 3.7 x 3.7: 37 0,0
SOP50P490X110-10N = smd 1.5 x 0.28: 1 -2.105,1; 2 -2.105,0.5; 3 -2.105,0; 4 -2.105,-0.5; 5 -2.105,-1; 6 2.105,-1; 7 2.105,-0.5; 8 2.105,0; 9 2.105,0.5; 10 2.105,1
IC_TPD4EUSB30DQAR = smd 0.565 x 0.2: 1 -0.417,1; 2 -0.417,0.5; 4 -0.417,-0.5; 5 -0.417,-1; 6 0.417,-1; 7 0.417,-0.5; 9 0.417,0.5; 10 0.417,1 | smd 0.565 x 0.4: 3 -0.417,0; 8 0.417,0
SOT95P280X145-6N = smd 1.32 x 0.59: 1 -1.145,0.95; 2 -1.145,0; 3 -1.145,-0.95; 4 1.145,-0.95; 5 1.145,0; 6 1.145,0.95
DPR0010A = smd 0.6 x 0.3: 1 -1.9,1.6; 2 -1.9,0.8; 3 -1.9,0; 4 -1.9,-0.8; 5 -1.9,-1.6; 6 1.9,-1.6; 7 1.9,-0.8; 8 1.9,0; 9 1.9,0.8; 10 1.9,1.6 | smd 2.6 x 3: 11 0,0 | drill 0.203 pad 0.5: V -1,0; V_1 0,-1.2; V_2 0,0; V_3 0,1.2; V_4 1,0
SOT23_NXP-L = smd 0.508 x 1.016: 1 -0.953,-0.894; 2 0.953,-0.894; 3 0,0.796
SOIC127P600X175-16N = smd 1.9 x 0.6: 1 -2.455,4.445; 2 -2.455,3.175; 3 -2.455,1.905; 4 -2.455,0.635; 5 -2.455,-0.635; 6 -2.455,-1.905; 7 -2.455,-3.175; 8 -2.455,-4.445; 9 2.455,-4.445; 10 2.455,-3.175; 11 2.455,-1.905; 12 2.455,-0.635; 13 2.455,0.635; 14 2.455,1.905; 15 2.455,3.175; 16 2.455,4.445
TERMBLK_508-2N = drill 1.2: 1 0,0; 2 5.08,0
TERMBLK_508-3N = drill 1.2: 1 0,0; 2 5.08,0; 3 10.16,0
1X05 = drill 1.016 long: 1 -5.08,0; 2 -2.54,0; 3 0,0; 4 2.54,0; 5 5.08,0
ABLS = smd 5.6 x 2.1: 1 -4.75,0; 2 4.75,0

## Placement (x,y rotation side)
C1  27pF  [CAPC3216X135]  58.57,68.77 0 top
C2  27pF  [CAPC3216X135]  58.57,85.28 0 top
C3  10u  [CAPC3216X135]  52.22,63.69 0 top
C4  10u  [CAPC3216X135]  52.22,59.88 0 top
C5  100n  [CAPC3216X135]  52.22,56.07 0 top
C6  100n  [CAPC3216X135]  52.22,52.26 0 top
C7  100n  [CAPC3216X135]  52.22,48.45 0 top
C8  100n  [CAPC3216X135]  52.22,44.64 0 top
C9  100n  [CAPC3216X135]  52.22,40.83 0 top
C10  100n  [CAPC3216X135]  52.22,37.02 0 top
C11  10uF  [CAPC3216X135]  109.37,75.12 270 top
C12  10uF  [CAPC3216X135]  113.18,75.12 270 top
C13  10uF  [CAPC3216X135]  116.99,75.12 270 top
C14  10uF  [CAPC3216X135]  120.8,75.12 270 top
C15  100uF  [CAP_20TDC100MYF]  103.02,75.12 0 top
C16  10uF  [CAPC3216X135]  88.84,76.39 270 top
C17  EEEFC1H2R2R  [EEE1AA220WR]  20.47,78.93 270 top
C18  2.7nF  [CAPC3216X135]  20.47,85.28 180 top
C19  GRM32EC81C476KE15L  [CAPC3225X270N]  40.79,81.47 270 top
C20  6.8pF  [CAPC3216X135]  33.17,77.66 0 top
C21  100nF  [CAPC3216X135]  26.82,85.28 180 top
C22  CGA4C2C0G1H472J060AA  [CAPC2012X75N]  25.55,73.85 180 top
C23  EEEFC1H2R2R  [EEE1AA220WR]  9.95,64.66 270 top
C24  100nF  [CAPC3216X135]  37.08,38.29 90 top
C25  22pF  [CAPC3216X135]  42.47,39.76 0 top
C26  12nF  [CAPC3216X135]  41.45,43.11 0 top
C27  10nF  [CAPC3216X135]  40.85,46.16 0 top
C28  EMK107B7105KA-T  [CAPC1608X90N]  33.27,39.56 270 top
C29  C3216X5R1H106K160AB  [CAPC3216X180N]  47.44,55.66 90 top
C30  CGA3E2X7R1H104K080AA  [CAPC1608X90N']  43.94,56.12 90 top
C31  0.1uF  [CAPC3216X135]  21.74,28.13 0 top
C32  EEEFC1H2R2R  [EEE1AA220WR]  144.93,35.75 270 top
C33  0.1uF  [CAPC3216X135]  54.76,20.51 270 top
C34  15uF  [CAPC3216X135]  29.36,28.13 180 top
C35  0.1uF  [CAPC3216X135]  31.9,23.05 270 top
C36  0.1uF  [CAPC3216X135]  36.98,21.78 270 top
C37  100nF  [CAPC3216X135]  155.09,19.24 90 top
C38  18pF  [CAPC3216X135]  166.52,16.7 0 top
C39  10nF  [CAPC3216X135]  161.44,20.51 0 top
C40  10nF  [CAPC3216X135]  162.71,26.86 0 top
C41  EMK107B7105KA-T  [CAPC1608X90N]  153.82,26.86 90 top
C42  C3216X5R1H106K160AB  [CAPC3216X180N]  153.82,14.16 0 top
C43  CGA3E2X7R1H104K080AA  [CAPC1608X90N']  153.82,10.35 0 top
CR1  SMBJ54ASMBJSERIES_LTF-L  [SMBJSERIES_LTF-L]  14.12,75.12 270 top
CR2  B220A-13-FSMA_DIO  [SMA_DIO]  150.01,24.32 90 top
D1  1N4148WS  [SOD-323]  124.61,81.47 270 top
D2  LED_RED  [LEDC3216X75N_FLAT-R]  127.15,78.93 90 top
D3  1N4148WS  [SOD-323]  124.61,70.04 270 top
D4  LED_RED  [LEDC3216X75N_FLAT-R]  109.37,80.2 0 top
D5  LED_RED  [LEDC3216X75N_FLAT-R]  127.15,67.5 90 top
D6  1N4148WS  [SOD-323]  124.61,59.88 270 top
D7  LED_RED  [LEDC3216X75N_FLAT-R]  127.15,57.34 90 top
D8  1N4148WS  [SOD-323]  124.61,49.72 270 top
D9  STPS30M60SG-TR  [T1210T8G]  17.93,62.42 0 top
D10  B240A-13-F  [DIOM5226X230N]  37.08,52.26 180 top
D11  LED_RED  [LEDC3216X75N_FLAT-R]  127.15,47.18 90 top
FU1  696103201002  [696103201002]  30.63,92.9 0 top
H1  MOUNT-PAD-ROUND3.3  [3,3-PAD]  5.01,94.98 0 top
H2  MOUNT-PAD-ROUND3.3  [3,3-PAD]  4.99,4.99 0 top
H3  MOUNT-PAD-ROUND3.3  [3,3-PAD]  164.97,94.98 0 top
H4  MOUNT-PAD-ROUND3.3  [3,3-PAD]  165.01,4.98 90 top
IC1  LM5157QRTERQ1  [QFN50P300X300X80-17N]  157.63,25.59 0 top
IC2  DAC8551IDGKR  [SOP65P490X110-8N]  48.41,23.05 180 top
IC3  XTR117AIDGKR  [SOP65P490X110-8N]  48.41,14.16 180 top
IC4  LM5157QRTERQ1  [QFN50P300X300X80-17N]  34.54,44.64 90 top
J1  DF40C-100DS-0.4V(51)  [HIROSE_DF40C-100DS-0.4V(51)]  87.12,68.45 0 top
J2  ZX62D-B-5P8  [HRS_ZX62D-B-5P8]  77.62,97.5 180 top
J3  USB1035-XX-X-X-X-B_REVE  [GCT_USB1035-XX-X-X-X-B_REVE]  57.3,96.91 180 top
J4  DF40C-100DS-0.4V(51)  [HIROSE_DF40C-100DS-0.4V(51)]  87.12,34.45 0 top
J5  PCIE-036-02-X-D-RA  [SAMTEC_PCIE-036-02-X-D-RA]  137.31,15.43 270 top
J6  2828XX-4282837-4  [TERMBLK_508-4N]  8.2,32.93 270 top
J7  1-1734248-5  [117342485]  115.72,94.78 0 top
JP2  PINHD-2X2  [2X02]  99.21,95.44 0 top
JP3  PINHD-2X5  [2X05]  16.66,6.54 0 top
JP4  [1X02]  37.44,57.34 270 top
JP6  [2X07]  57.71,45.91 270 top
JP8  [1X02]  42.06,31.94 180 top
JP10  [1X03]  122.07,37.02 180 top
JP11  [1X03]  122.07,40.83 180 top
L1  XAL6060-103MEB  [XAL6060-103MEB]  33.17,84.01 0 top
L2  SDR1307-270ML  [SDR1307270ML]  23.47,47.99 270 top
L3  SRN8040-1R5Y  [SRN80408R2Y]  155.09,33.21 270 top
R1  0  [RESC3216X70]  111.91,84.01 180 top
R2  1k  [RESC3216X70]  101.75,80.2 0 top
R3  2.2k 1%  [RESC3216X70]  77.62,87.82 180 top
R4  15k 1%  [RESC3216X70]  92.86,73.85 0 top
R5  2.2k 1%  [RESC3216X70]  81.43,89.09 270 top
R6  36K 1%  [RESC3216X70]  70,90.36 315 top
R7  36K 1%  [RESC3216X70]  72.54,91.63 315 top
R8  12k 1%  [RESC3216X70]  71.27,72.58 0 top
R9  2.2k 1%  [RESC3216X70]  95.4,87.82 270 top
R10  2.2k 1%  [RESC3216X70]  98.45,87.82 270 top
R11  36K 1%  [RESC3216X70]  68.73,87.82 315 top
R12  36K 1%  [RESC3216X70]  67.46,80.2 0 top
R13  221kΩ  [RESC3216X70]  20.47,72.58 0 top
R14  28.7kΩ  [RESC3216X70]  30.63,71.31 0 top
R15  1kΩ  [RESC3216X70]  40.79,68.77 90 top
R16  60.4kΩ  [RESC3216X70]  36.98,73.85 90 top
R17  11.5kΩ  [RESC3216X70]  36.98,68.77 90 top
R18  845Ω  [RESC3216X70]  47.13,42.1 180 top
R19  9.76kΩ  [RESC3216X70]  42.16,36.31 180 top
R20  57.6kΩ  [RESC3216X70]  45.51,49.41 90 top
R21  2.49kΩ  [RESC3216X70]  40.13,49 180 top
R22  499  [RESC3216X70]  40.79,63.69 90 top
R23  25k  [RESC3216X70]  16.66,33.21 180 top
R24  1k  [RESC3216X70]  116.99,78.93 0 top
R25  1k  [RESC3216X70]  127.15,84.01 90 top
R26  1k  [RESC3216X70]  116.99,71.31 0 top
R27  1k  [RESC3216X70]  127.15,72.58 90 top
R28  1k  [RESC3216X70]  116.99,61.15 0 top
R29  1k  [RESC3216X70]  127.15,62.42 90 top
R30  1k  [RESC3216X70]  116.99,50.99 0 top
R31  1k  [RESC3216X70]  127.15,52.26 90 top
R32  20k  [RESC3216X70]  48.41,19.24 0 top
R33  250  [RESC3216X70]  29.36,31.94 0 top
R34  1k  [RESC3216X70]  43.33,10.35 90 top
R35  2k  [RESC3216X70]  43.33,5.27 90 top
R36  1k  [RESC3216X70]  39.52,10.35 90 top
R37  2k  [RESC3216X70]  39.52,5.27 90 top
R38  1k  [RESC3216X70]  35.71,10.35 90 top
R39  2k  [RESC3216X70]  35.71,5.27 90 top
R40  1k  [RESC3216X70]  31.9,10.35 90 top
R41  2k  [RESC3216X70]  31.9,5.27 90 top
R42  25k  [RESC3216X70]  21.74,33.21 180 top
R43  590Ω  [RESC3216X70]  166.52,20.51 180 top
R44  9.76kΩ  [RESC3216X70]  160.17,14.16 180 top
R45  27.4kΩ  [RESC3216X70]  167.79,26.86 90 top
R46  2.49kΩ  [RESC3216X70]  163.98,24.32 180 top
RELAY1  ZETTLER_5V_RELAY  [ZETTLER_5V_RELAY]  132.23,85.28 0 top
RELAY2  ZETTLER_5V_RELAY  [ZETTLER_5V_RELAY]  132.23,73.85 0 top
RELAY3  ZETTLER_5V_RELAY  [ZETTLER_5V_RELAY]  132.23,62.42 0 top
RELAY4  ZETTLER_5V_RELAY  [ZETTLER_5V_RELAY]  132.23,50.99 0 top
TP1  TPB1,27  [B1,27]  47.14,75.12 0 top
TP2  TPB1,27  [B1,27]  45.87,67.5 0 top
TP3  TPB1,27  [B1,27]  45.92,62.37 0 top
TP4  TPB1,27  [B1,27]  158.9,9.08 0 top
U1  74LVC1G07SE-7  [SOT65P210X110-5N]  92.86,81.47 0 top
U2  74LVC1G07SE-7  [SOT65P210X110-5N]  58.57,59.88 0 top
U3  USB2514B-I/M2  [QFN50P600X600X100-37N]  80.16,80.2 135 top
U4  FSUSB42MUX  [SOP50P490X110-10N]  87.78,91.63 135 top
U5  TPD4EUSB30DQAR  [IC_TPD4EUSB30DQAR]  85.24,86.55 225 top
U6  AP22653W6-7  [SOT95P280X145-6N]  94.13,77.66 0 top
U7  TPS54561QDPRRQ1DPR0010A  [DPR0010A]  26.82,78.93 0 top
U8  BC847SOT23_NXP-L  [SOT23_NXP-L]  122.07,81.47 270 top
U9  BC847SOT23_NXP-L  [SOT23_NXP-L]  122.07,70.04 270 top
U10  BC847SOT23_NXP-L  [SOT23_NXP-L]  122.07,59.88 270 top
U11  BC847SOT23_NXP-L  [SOT23_NXP-L]  122.07,49.72 270 top
U13  MCP3008-I/SL  [SOIC127P600X175-16N]  24.28,16.7 0 top
U14  BC847SOT23_NXP-L  [SOT23_NXP-L]  58.57,12.89 0 top
U$1  2828XX-2282837-2  [TERMBLK_508-2N]  6.5,78.93 90 top
U$2  2828XX-3282837-3  [TERMBLK_508-3N]  160.17,75.12 90 top
U$3  2828XX-3282837-3  [TERMBLK_508-3N]  159.77,54.8 90 top
U$3_SENSOR1  2828XX-2282837-2  [TERMBLK_508-2N]  9.04,42.1 90 top
U$4  2828XX-2282837-2  [TERMBLK_508-2N]  160.17,47.18 270 top
U$5  PINHD-1X05_1X05M  [1X05]  148.74,96.11 0 top
Y1  ABLS-24.000MHZ-B2-T  [ABLS]  52.22,77.66 90 top

## Tracks (layer width: path | path; a pad name or v marks a point on that pad's centre or on a via)
!EXTRST  (via drill 0.35)
  Top 0.152: v75.08,81.47 76.35,81.47 76.36,81.48 76.76,81.48 U3.26 | J1.100 76.35,65.94 76.35,65.82 v75.92,65.39
  Route13 0.152: v75.08,81.47 72.54,81.47 68.73,77.66 68.73,72.58 71.93,69.38 71.93,67.25 72.29,66.89 74.42,66.89 v75.92,65.39
!RPIBOOT  (via drill 0.35)
  Top 0.152: JP6.2 59.84,54.39 v59.84,55.46 | J1.93 78.59,70.06 78.59,70.44 78.89,70.73 v78.89,71.31
  Route3 0.152: v78.89,71.31 77.62,72.58 75.46,72.58 59.84,56.96 v59.84,55.46
+1.8V
  Top 0.2: J1.88 J1.90
+3V3  (via drill 0.35, 0.5)
  Top 0.152: 76.97,79.13 U3.29 76.76,78.92 76.36,78.92 76.35,78.93 72.14,78.93 71.31,78.09 v70.66,78.09 | U3.15 82.7,83.45 v82.7,84.01 | U3.10 86.72,83.94 v86.72,84.22 | U3.27 76.38,80.4 v72.34,80.4 | U3.36 80.16,76.22 v80.16,73.85 | v89.05,87.82 88.56,88.31 U4.1 | U3.5 82.35,78.21 82.7,77.86 82.78,77.86 83.28,77.36 83.42,77.36 83.72,77.05 84.58,77.05 v85.24,76.39 | v81.43,63.69 80.52,64.6 J1.84 | J1.86 80.16,66.87 v80.16,63.69 | J7.15 108.72,97.36 v108.1,97.98 109.72,96.36 J7.14
  Top 0.254: D4.A 113.18,80.2 114.45,81.47 v115.13,81.47 | U1.5 91.97,84.01 v91.59,84.01 | R1.1 115.72,84.01 116.99,82.74 v117.58,82.74 | v73.65,88.11 73.68,88.09 73.68,86.56 75.28,84.96 75.4,84.96 U3.23
  Top 0.305: v50.95,66.23 50.95,64.1 50.75,63.9 C3.1 C4.1 C5.1 C6.1 C7.1 C8.1 C9.1 C10.1
  pour Route4: 1.42,99.25 1.42,1.46 169.06,1.46 169.06,99.25
+5V  (via drill 0.35, 0.5)  (1 unrouted)
  Top 0.152: D8.C 123.34,52.03 v123.34,53.53 123.55,53.74 R31.2 | D6.C v124.61,63.69 124.81,63.9 R29.2 | R27.2 124.81,74.06 v124.61,73.85 D3.C | D1.C v124.61,85.28 124.81,85.49 R25.2 | J1.87 79.72,70.87 v80.16,71.31 | J1.83 80.52,70.95 v80.16,71.31 | J1.85 80.16,70.03 v80.16,71.31 | J1.81 80.92,70.8 v81.43,71.31 81.32,71.2 J1.79 | v82.7,71.31 81.96,70.57 81.92,70.57 81.72,70.36 J1.77 | IC1.6 157.38,22.8 155.29,20.72 C37.2 155.09,21.78 | IC1.3 156.01,25.22 155.63,25.22 155.09,24.67 155.09,21.78 | v153.82,23.05 155.09,21.78
  Top 0.2: R25.2 128.22,86.55 133.5,86.55 134.77,85.28 134.77,81.47 133.88,80.58 RELAY1.COIL+ | R27.2 128.22,75.12 133.5,75.12 134.77,73.85 134.77,70.04 133.88,69.15 RELAY2.COIL+ | R29.2 127.35,63.9 128.42,64.96 133.5,64.96 134.77,63.69 134.77,59.88 132.61,57.72 RELAY3.COIL+ | R31.2 128.22,54.8 132.23,54.8 134.77,52.26 134.77,48.45 132.61,46.29 RELAY4.COIL+
  Top 0.203: IC4.6 36.14,44.29 36.55,44.29 37.1,43.74 37.1,41.18 37.08,41.16 C24.2 35.28,41.57 | IC4.3 34.79,42.06 35.28,41.57 | L2.1 19.2,47.64 19.2,38.29 20.47,37.02 34.54,37.02 35.28,37.76 35.28,41.57
  Top 0.254: U2.5 60.19,61.15 v61.11,61.15
  Top 0.305: 31.47,24.96 C35.1 | U13.16 30.12,24.53 C35.1 | v38.25,28.13 34.64,24.53 C35.1 | U13.15 32.54,19.88 35.92,23.26 C36.1 39.31,23.26 v39.52,23.05 | v56.03,24.32 56.03,23.26 C33.1 54.67,22.08 IC2.1 | v53.49,24.32 51.89,22.73 IC2.2
  Top 0.406: C19.1 44.53,86.55 v47.14,86.55 | C19.1 48.34,82.81 v48.41,82.74 | C19.1 42.13,81.47 v47.14,81.47 | C19.1 44.67,78.93 v47.14,78.93 | 36.98,78.93 36.98,82.22 L1.2 39.59,84.01 C19.1 | 36.98,78.93 R16.2 | 40.66,82.94 C19.1 | v3.6,62.12 6.14,64.66 | 6.14,64.66 7.89,66.41 C23.1 | v3.6,64.66 5.35,66.41 C23.1 | C23.1 6.62,69.74 v3.6,69.74 | v3.6,67.19 9.16,67.19 C23.1 | TP1.TP 40.79,75.12 36.98,78.93 | 18.84,47.18 L2.1 | v3.6,72.28 6.14,72.28 9.95,68.47 C23.1 | C19.1 42.13,82.81 43.33,84.01 v47.14,84.01 | v6.14,62.12 6.14,64.66 | U6.1 92.69,78.31 92.22,78.31 91.78,77.87 C16.1 89.05,78.07 89.05,80.2 v89.53,80.68
  Top 0.508: 144.93,37.02 C32.1 | v139.85,37.02 142.39,37.02 | 142.39,37.02 144.45,37.02 C32.1 | v139.85,39.56 142.87,39.56 C32.1 | v139.85,42.1 143.66,42.1 144.93,40.83 C32.1 | v139.85,34.48 142.39,37.02
  Top 1.016: C32.1 153.6,37.5 L3.1
  Top 1.27: L2.1 11.54,55.29 11.54,64.48 9.95,66.07 C23.1
  pour Route2: 1.42,99.25 1.42,1.46 169.06,1.46 169.06,99.25
+12V  (via drill 0.5)
  Top 0.152: J5.A02 140.56,6.93 J5.A03 | J5.A03 J5.B03 | J5.B03 145.06,6.93 J5.B02 145.06,5.93 J5.B01 | J5.B01 J5.B03 | J5.A03 143.56,5.93 J5.B01
  Top 0.305: v155.09,7.81 156.36,9.08 TP4.TP
  Top 0.508: R45.2 166.52,29.61 v166.52,30.67 | v152.55,19.24 151.28,19.24 150.01,20.51
  Top 0.61: CR2.1 150.01,20.51 150.01,16.37 C42.1 153.02,13.36 C43.1 | v151.28,7.81 151.28,8.61 C43.1 | v148.74,7.81 151.28,10.35 C43.1 | v155.09,7.81 153.02,9.88 C43.1
  Route3 0.305: v148.74,7.81 147.86,6.93 J5.B02 | v151.28,7.81 149.4,5.93 J5.B01
  Route13 0.305: v155.09,7.81 151.28,4 143.66,4 142.47,5.19 142.47,6.31 141.56,7.22 J5.A03 | v151.28,7.81 146.2,2.73 142.39,2.73 139.56,5.56 J5.A02 | v148.74,7.81 144.18,7.81 J5.B03
  Route13 0.508: v152.55,19.24 155.57,22.27 156.69,22.27 165.09,30.67 v166.52,30.67
+24V  (via drill 0.35, 0.5)
  Top 0.305: 45.87,62.37 TP3.TP | IC3.7 46.09,13.96 45.38,13.96 45.18,14.16 v43.33,14.16 | v57.3,17.97 57.3,16.7 v56.03,15.43
  Top 0.406: v40.79,54.8 43.42,54.8 C30.1 42.81,55.32 42.06,56.07 | 42.06,56.07 v40.79,57.34 | v40.79,59.88 42.06,58.61 42.06,56.07 | v56.03,15.43 56.83,15.43 U14.3 60.31,15.43 v61.11,15.43 | IC3.4 51.92,15.14 v52.22,15.43
  Top 0.508: D10.1 44.14,52.26 R20.2 46.78,52.16 46.78,54.06 C29.1 46.19,55.32 C30.1 | TP3.TP 42.16,58.61 42.06,58.61
  Route3 0.406: v40.79,54.8 29.84,43.86 29.84,35.27 | U$3_SENSOR1.2 19.2,47.18 25.55,40.83 | 25.55,15.43 13.13,27.85 J6.2 | v40.79,59.88 39.52,59.88 38.25,61.15 31.9,61.15 30.63,59.88 30.63,47.18 | v43.33,14.16 29.84,27.65 29.84,35.27 | v52.22,15.43 v56.03,15.43 | v57.3,17.97 44.6,30.67 34.44,30.67 29.84,35.27
  Route3 0.508: v40.79,57.34 30.63,47.18 25.55,42.1 25.55,40.83 25.55,15.43 25.55,9.08 31.9,2.73 49.59,2.73 50.55,1.77 53.89,1.77 54.85,2.73 151.28,2.73 153.41,4.86 153.41,19.6 152.55,20.46 152.55,37.47 RELAY4.IN RELAY3.IN RELAY2.IN RELAY1.IN
  Route13 0.406: v61.11,15.43 128.42,15.43 U$4.1
ANALOGP0  (via drill 0.35)  (1 unrouted)
  Top 0.152: J1.96 78.12,65.46 76.35,63.69 v72.54,63.69 v70,63.69
  Top 0.2: v54.76,49.72 55.17,49.72 JP6.5
  Route3 0.152: v70,63.69 59.97,53.66 59.97,53.12 59.39,52.54 59.12,52.54 57.43,50.84 57.43,50.58 56.57,49.72 v54.76,49.72
  Route15 0.152: 102.31,-14.59 102.31,-15.35 102.46,-15.51 102.46,-16.57 91.79,-27.24 91.79,-50.71 90.73,-51.78 90.73,-51.88
ANALOGP1  (via drill 0.35)
  Top 0.152: J1.94 78.52,64.59 v77.62,63.69 | JP6.6 59.84,48.45 60.7,49.31 v61.52,49.31
  Route3 0.152: v77.62,63.69 77.62,61.15 75.08,58.61 68.73,58.61 61.52,51.4 v61.52,49.31
BMS_OUT1
  Route3 0.406: RELAY1.OUT 156.19,75.12 U$2.1
BMS_OUT2
  Top 0.406: RELAY2.OUT 157.63,76.05 157.63,80.2 160.17,82.74 U$2.3
CLK_ADC
  Top 0.152: R34.2 37.82,17.34 U13.13
DAC_OUT
  Top 0.406: JP8.1 50.61,24.66 IC2.4 IC2.3
DIN_ADC
  Top 0.152: R38.2 34.23,11.83 31.27,14.8 U13.11
DOUT_ADC
  Top 0.152: R36.2 38.05,11.83 33.8,16.07 U13.12
DSI1_C_N  (via drill 0.35)
  Top 0.152: J4.87 79.72,37.85 v80.16,38.29 | J7.5 118.72,97.52 v118.26,97.98
  Bottom 0.152: v80.16,38.29 118.26,76.39 v118.26,97.98
DSI1_C_P  (via drill 0.35)
  Top 0.152: J4.89 79.32,37.86 v78.89,38.29 | J7.6 117.72,97.25 v116.99,97.98
  Bottom 0.152: v78.89,38.29 112.14,71.54 112.14,71.99 112.5,72.35 112.95,72.35 116.99,76.39 116.99,82.36 116.9,82.46 116.9,83.02 116.99,83.12 v116.99,97.98
DSI1_D0_N  (via drill 0.35)
  Top 0.152: J4.75 82.19,36.06 82.19,36.44 82.33,36.57 82.7,36.57 83.15,37.02 83.97,37.02 v85.24,38.29 | J7.8 v115.72,97.98
  Route3 0.152: v85.24,38.29 85.24,45.91 87.78,48.45 v87.35,48.88
  Bottom 0.152: v115.72,97.98 115.72,81.85 115.81,81.75 115.81,81.19 115.72,81.09 115.72,76.39 92.5,53.17 92.5,53.15 91.97,52.62 91.95,52.62 87.78,48.45 v87.35,48.88
DSI1_D0_P  (via drill 0.35)
  Top 0.152: J4.77 81.72,36.04 81.79,36.11 81.79,36.44 81.89,36.53 81.89,36.56 82.2,36.87 82.55,36.87 v83.97,38.29 | J7.9 114.45,95.03 v114.45,97.98
  Route3 0.152: v83.97,38.29 83.97,45.91 v85.24,47.18
  Bottom 0.152: v114.45,97.98 114.45,76.39 92.02,53.96 92.2,53.78 92.2,53.28 91.84,52.92 91.34,52.92 91.16,53.1 87.55,49.49 87.1,49.49 86.74,49.13 86.74,48.68 v85.24,47.18
DSI1_D1_N  (via drill 0.35)
  Top 0.152: J4.81 80.92,36.51 v82.7,38.29 | J7.2 121.72,97.06 v120.8,97.98
  Bottom 0.152: v82.7,38.29 120.8,76.39 v120.8,97.98
DSI1_D1_P  (via drill 0.35)
  Top 0.152: J4.83 80.52,37.38 v81.43,38.29 | J7.3 120.72,96.79 v119.53,97.98
  Bottom 0.152: v81.43,38.29 119.53,76.39 v119.53,97.98
EEPROM_!WP  (via drill 0.35)
  Top 0.152: J1.20 93.32,65.01 93.09,64.78 93.09,64.28 93.45,63.92 93.9,63.92 v94.14,63.68
  Bottom 0.152: JP6.4 81.43,50.99 94.12,63.68 v94.14,63.68
ETH_SYNC_IN  (via drill 0.35)
  Top 0.152: JP6.8 61.11,45.91 v61.54,45.48 | J1.16 94.12,65.83 94.74,65.2 94.74,63.08 v95.4,62.42
  Route3 0.152: v95.4,62.42 95.4,61.15 90.32,56.07 72.13,56.07 v61.54,45.48
ETH_SYNC_OUT  (via drill 0.35)  (1 unrouted)
  Top 0.152: J1.18 93.65,66.84 93.65,65.44 93.7,65.39 v93.7,64.53
  Route15 0.152: 94.38,-20.54 86.61,-12.76
  Bottom 0.152: JP6.9 57.71,44.64 73.81,44.64 79.86,50.69 81.56,50.69 93.95,63.08 94.39,63.08 94.74,63.43 94.74,63.93 94.15,64.53 v93.7,64.53
GLOBAL_EN  (via drill 0.35)
  Top 0.152: JP11.3 115.72,44.64 v108.1,44.64 | J1.99 76.35,70.96 76.35,71.31 v75.92,71.74 | 73.81,53.12 v73.81,59.88 | v100.48,44.64 82.29,44.64 73.81,53.12 | 73.81,53.12 64.26,43.57 64.26,43.12 63.9,42.76 63.45,42.76 JP6.14
  Route3 0.152: v100.48,44.64 v108.1,44.64 | v73.81,59.88 71.27,62.42 71.27,67.91 75.1,71.74 v75.92,71.74
GND  (via drill 0.35, 0.5, 0.7)  (2 unrouted)
  Top 0.152: 88.74,66.23 88.74,66.36 88.92,66.54 J1.42
  Top 0.2: IC4.16 33.79,43.89 IC4.17 | IC4.11 34.39,46.05 34.39,45.64 34.54,45.48 IC4.17 | IC4.7 35.94,44.79 35.54,44.79 35.39,44.64 IC4.17
  Top 0.254: IC1.7 157.81,24.16 157.81,24.61 157.63,24.79 IC1.17 | IC1.11 159.06,25.77 158.61,25.77 158.44,25.59 IC1.17 | IC1.1 156.88,26.34 IC1.17 | IC1.16 156.95,27.02 156.95,26.57 157.63,25.9 IC1.17
  other vias: 78.89,80.2 80.16,81.47 80.16,78.93 81.43,80.2 80.16,80.2 90.32,96.71 91.59,96.71 92.86,96.71 94.13,96.71 85.24,4 86.51,4 87.78,4 89.05,4 7.77,52.26 7.77,53.53 7.77,54.8 7.77,56.07 129.69,37.02 129.69,38.29 129.69,39.56 129.69,40.83 92.86,4 95.4,4 97.94,4 100.48,4 129.69,96.71 132.23,96.71 134.77,96.71 137.31,96.71 132.23,35.75 132.23,37.02 132.23,38.29 132.23,39.56 50.95,2.73 53.49,2.73 5.23,56.07 5.23,53.53 5.23,50.99
  pour Top: 1.42,99.25 1.42,1.46 169.06,1.46 169.06,99.25
  pour Bottom: 1.42,99.25 1.42,1.46 169.06,1.46 169.06,99.25
  pour Route14: 1.42,97.98 1.42,2.73 2.69,1.46 166.52,1.46 169.06,4 169.06,96.71 166.52,99.25 2.69,99.25
  pour Route15: 1.42,95.44 1.42,4 3.96,1.46 166.52,1.46 169.06,4 169.06,96.71 166.52,99.25 5.23,99.25
GPIO7  (via drill 0.35)
  Top 0.2: J1.37 89.77,70.04 89.77,70.48 90.32,71.03 v90.32,72.58 | IC2.5 44.64,25.59 v44.6,25.59
  Route3 0.2: v63.65,43.37 71.27,50.99 v71.27,53.53
  Bottom 0.2: v44.6,25.59 56.29,37.28 56.86,37.28 57.45,37.87 57.45,38.2 59.07,39.82 59.4,39.82 62.95,43.37 v63.65,43.37 | v71.27,53.53 78.89,61.15 83.97,61.15 85.24,62.42 85.24,67.5 v90.32,72.58
GPIO8  (via drill 0.35)
  Top 0.152: R41.2 R40.1 32.97,7.81 v33.17,7.81 | v99.21,70.04 97.94,68.77 90.17,68.77 89.32,69.62 J1.39
  Route3 0.152: v100.48,66.23 99.21,67.5 v99.21,70.04
  Route13 0.152: v100.48,66.23 100.48,63.69 97.33,60.54 85.9,60.54 v33.17,7.81
GPIO9  (via drill 0.35)
  Top 0.152: R37.2 R36.1 41.3,7.1 v41.34,7.1 | v86.51,59.88 86.51,56.07 v89.05,53.53 | J1.40 89.25,66.84 89.25,66.43 89.05,66.24 v89.05,64.96
  Route13 0.152: v89.05,53.53 87.78,53.53 v41.34,7.1 | v86.51,59.88 89.05,62.42 v89.05,64.96
GPIO10  (via drill 0.35)
  Top 0.152: R39.2 R38.1 36.77,7.81 v36.98,7.81 | v103.02,66.23 101.75,67.5 88.74,67.5 88.52,67.28 J1.44
  Top 0.2: v43.33,21.78 44.27,22.73 IC2.7
  Route3 0.2: v43.33,21.78 43.33,20.51 47.14,16.7 47.14,11.62 43.33,7.81 v36.98,7.81
  Route13 0.152: v103.02,66.23 103.02,58.61 100.48,56.07 86.1,56.07 43.58,13.55 42.72,13.55 v36.98,7.81
GPIO11  (via drill 0.35)
  Top 0.152: R35.2 R34.1 44.39,7.81 v44.6,7.81 | J1.38 89.72,64.29 v90.32,63.69
  Top 0.2: IC2.6 42.39,23.38 v42.06,23.05
  Route3 0.152: v90.31,57.33 91.59,58.61 91.59,59.88 v90.32,61.15
  Route13 0.152: v91.59,53.53 90.32,53.53 52.83,16.04 51.97,16.04 51.61,15.68 51.61,14.82 v44.6,7.81
  Bottom 0.152: v91.59,53.53 90.32,54.8 v90.32,57.32 v90.31,57.33 | v90.32,61.15 v90.32,63.69
  Bottom 0.2: v42.06,23.05 42.06,10.35 v44.6,7.81
GPIO17  (via drill 0.35)
  Top 0.152: v86.51,64.96 87.32,65.77 J1.50 | v113.18,78.93 R24.1
  Route13 0.152: v86.51,64.96 100.48,78.93 v113.18,78.93
GPIO22  (via drill 0.35)
  Top 0.152: J1.46 88.12,64.03 v87.78,63.69 | R26.1 113.18,71.31 v112.75,71.74
  Route3 0.152: v112.75,71.74 112.75,69.61 110.64,67.5 103.02,67.5 98.6,63.08 93.89,63.08 93.88,63.08 90.07,63.08 89.46,63.69 v87.78,63.69
GPIO25  (via drill 0.35)
  Top 0.152: v113.18,50.99 R30.1 | J1.41 88.99,70.06 88.99,70.29 88.72,70.57 88.52,70.57 v87.78,71.31
  Route4 0.152: v87.78,71.31 108.1,50.99 v113.18,50.99
GPIO27  (via drill 0.35)
  Top 0.152: v113.18,61.15 R28.1 | J1.48 87.72,65.17 v87.51,64.96
  Route13 0.152: v113.18,61.15 113.18,62.42 108.1,67.5 90.32,67.5 87.78,64.96 v87.51,64.96
GPIO_VREF  (via drill 0.35, 0.4)
  Top 0.152: J1.78 81.72,65.94 v82.7,64.96 | v95.4,84.01 95.4,85.28
  Top 0.254: R9.2 95.4,85.28 97.94,82.74 100.48,82.74 | 100.48,82.74 v104.29,82.74 | R10.2 98.45,84.77 100.48,82.74
  Top 0.305: R1.2 v108.1,84.01
  Route3 0.305: v108.1,84.01 105.56,84.01 v104.29,82.74
  Route13 0.152: v82.7,64.96 82.7,67.5 89.05,73.85 89.05,77.66 v95.4,84.01
HD1_N  (via drill 0.35)
  Top 0.152: U3.1 80.74,75.15 v81.43,74.46
  Route3 0.152: v81.43,74.46 75.42,74.46 75.35,74.53 75.33,74.51 74.83,74.51 74.47,74.87 74.47,75.37 74.49,75.39 74.08,75.8 74.06,75.78 73.56,75.78 73.2,76.14 73.2,76.64 73.22,76.66 72.81,77.07 72.79,77.05 72.29,77.05 71.93,77.41 71.93,77.91 71.95,77.93 J3.2A
HD1_P  (via drill 0.35)
  Top 0.152: U3.2 81.09,76.95 81.44,76.6 81.44,76.4 81.43,76.39 81.49,76.33 81.68,76.33 82.04,75.98 82.04,75.78 82.7,75.12 v82.48,74.9
  Route3 0.152: J3.3A 74.03,73.85 79.3,73.85 79.91,73.24 80.82,73.24 81.43,73.85 81.68,73.85 82.04,74.21 82.04,74.46 v82.48,74.9
HD2_N  (via drill 0.35)
  Top 0.152: U3.3 83.97,74.98 v83.97,73.85
  Route4 0.152: J3.2B 59.77,94.2 59.77,93.77 60.37,93.17 61.23,93.17 61.83,93.77 61.83,94.2 64.89,94.2 78.46,80.63 78.28,80.45 78.28,79.95 78.64,79.59 79.14,79.59 79.32,79.77 79.73,79.36 79.55,79.18 79.55,78.68 83.97,74.26 v83.97,73.85
HD2_P  (via drill 0.35)
  Top 0.152: U3.4 82,77.86 82.35,77.5 82.42,77.5 82.57,77.36 82.85,77.36 83.16,77.05 83.29,77.05 83.59,76.75 83.61,76.75 v85.24,75.12
  Route3 0.152: J3.3B 57.27,94.2 57.27,93.77 57.87,93.17 58.73,93.17 59.33,93.77 59.33,94.2 59.77,94.2 59.77,93.77 60.37,93.17 61.23,93.17 61.83,93.77 61.83,94.2 66.16,94.2 79.73,80.63 79.55,80.45 79.55,79.95 79.91,79.59 80.41,79.59 80.59,79.77 v85.24,75.12
HD3_N  (via drill 0.35)
  Top 0.152: U3.6 83.41,77.66 v83.97,77.66 | v15.39,10.35 15.39,6.54 JP3.3
  Route13 0.152: v83.97,77.66 85.24,77.66 86.51,76.39 86.51,73.85 81.43,68.77 80.16,68.77 61.31,49.92 61.27,49.92 60.92,49.56 60.92,49.53 59.97,48.58 59.97,48.04 59.39,47.46 58.85,47.46 57.43,46.04 57.43,45.5 56.85,44.92 56.31,44.92 44.03,32.64 43.74,32.93 42.92,32.93 42.34,32.35 42.34,31.53 42.63,31.24 39.12,27.73 39.22,27.64 39.22,26.84 38.65,26.27 37.85,26.27 37.76,26.37 28.58,17.19 28.49,17.29 27.69,17.29 27.12,16.72 27.12,15.92 27.22,15.83 23.98,12.59 23.98,12.11 23.41,11.54 22.93,11.54 21.74,10.35 17.27,10.35 17.27,10.6 16.91,10.96 16.41,10.96 16.05,10.6 16.05,10.35 v15.39,10.35
HD3_P  (via drill 0.35)
  Top 0.152: U3.7 83.04,78.93 83.41,78.56 83.61,78.56 83.66,78.61 84.09,78.61 84.4,78.93 v85.24,78.93 | JP3.5 v16.66,2.73 | v86.51,72.58 v89.05,72.58
  Route2 0.152: v86.51,72.58 86.51,77.66 v85.24,78.93 | v89.05,72.58 89.05,71.92 89.3,71.92 89.66,71.56 89.66,71.06 89.3,70.7 89.05,70.7 89.05,65.57 89.3,65.57 89.66,65.21 89.66,64.71 89.3,64.35 89.05,64.35 89.05,64.3 89.3,64.3 89.66,63.94 89.66,63.44 89.3,63.08 89.05,63.08 89.05,54.14 89.3,54.14 89.66,53.78 89.66,53.28 89.3,52.92 89.05,52.92 89.05,50.99 87.55,49.49 87.1,49.49 86.74,49.13 86.74,48.68 85.67,47.61 85.85,47.43 85.85,46.93 57.5,18.58 57.05,18.58 56.69,18.22 56.69,17.78 46.86,7.94 46.86,7.4 46.28,6.82 46.15,6.82 44.32,4.99 44.32,4.86 43.74,4.28 27.81,4.28 26.82,5.27 26.82,6.54 25.55,7.81 23.14,7.81 22.15,6.82 22.02,6.82 21.46,6.26 21.33,6.26 20.75,5.68 20.75,5.55 20.19,4.99 20.19,4.86 19.61,4.28 19.48,4.28 17.93,2.73 v16.66,2.73
HD4_N  (via drill 0.35)
  Top 0.152: U3.8 83.55,78.93 83.75,78.93 83.76,78.92 83.96,78.92 v86.51,81.47 | JP3.4 v14.12,10.35
  Route2 0.152: v14.12,10.35 14.12,15.35 30.12,15.35 30.18,15.41 30.23,15.35 38.65,15.35 39.22,15.92 39.22,22.5 38.91,22.8 38.91,23.3 39.22,23.61 39.22,35.45 | 39.22,35.45 | 39.22,35.45 56.17,52.4 55.45,53.12 55.45,53.94 56.03,54.52 56.85,54.52 56.93,54.43 83.97,81.47 v86.51,81.47
HD4_P  (via drill 0.35)
  Top 0.152: U3.9 86.51,82.57 v86.51,82.74 | v16.66,10.35 JP3.6
  Route2 0.152: v86.51,82.74 87.78,81.47 87.78,72.58 59.47,44.27 59.39,44.36 58.57,44.36 57.99,43.78 57.99,42.96 58.07,42.87 56.93,41.73 56.85,41.82 56.03,41.82 55.45,41.24 55.45,40.42 55.53,40.33 41.76,26.56 41.76,23.61 41.45,23.3 41.45,22.8 41.76,22.5 41.76,15.92 41.19,15.35 39.08,15.35 38.78,15.05 16.66,15.05 v16.66,10.35
ID_SC  (via drill 0.35)
  Top 0.152: JP2.1 96.67,92.9 96.67,92.49 v96.24,92.06 | J1.35 90.19,70.06 90.19,70.44 91.07,71.31 v91.59,71.31
  Route3 0.152: v91.59,71.31 95.63,75.35 97.35,75.35 97.94,75.94 97.94,87.82 96.67,89.09 96.67,91.63 v96.24,92.06
ID_SD  (via drill 0.35)
  Top 0.152: v100.48,91.63 JP2.3 | v91.59,64.96 91.59,65.07 90.19,66.47 90.19,66.84 J1.36
  Route3 0.152: v91.59,64.96 91.59,68.77 100.48,77.66 v100.48,91.63
N$1
  Top 0.406: J6.4 12.85,22.34 12.85,30.88 R23.2
N$2
  Top 0.152: D2.A R25.1
N$3
  Top 0.254: U1.4 96.18,80.82 96.35,80.98 99.49,80.98 R2.1
N$4
  Top 0.254: D4.C R2.2
N$5
  Top 0.152: JP6.13 56.44,39.43 55.45,40.42 55.45,41.24 56.58,42.38 56.85,42.38 57.43,42.96 57.43,54.93 59.84,57.34 59.84,58.96 U2.4
N$6
  Top 0.254: R7.2 73.58,90.4 74.31,89.67 74.31,86.5 75.45,85.36 75.7,85.36 U3.22
N$7
  Top 0.254: U3.24 77.25,82.4 77.23,82.4 71.04,88.58 R6.2
N$8
  Top 0.254: U3.25 77.33,81.48 76.52,82.3 74.25,82.3 R11.2
N$9
  Top 0.152: U3.28 69.51,79.62 R12.2
N$10
  Top 0.152: U3.35 74.66,72.58 R8.2
N$11
  Top 0.152: Y1.2 54.22,82.41 C2.1 67.25,75.12 72.54,75.12 73.81,73.85 74.67,73.85 75.69,74.87 75.69,75.02 U3.33
N$12  (via drill 0.35)
  Top 0.152: Y1.1 52.95,72.91 C1.1 57.09,71.11 v57.3,71.31 | U3.32 v75.08,75.12
  Route4 0.152: v75.08,75.12 71.27,71.31 v57.3,71.31
N$13  (via drill 0.35)
  Top 0.152: U3.31 77.62,78.56 77.26,78.21 75.63,78.21 v73.81,76.39 | v85.24,95.44 86.17,94.51 86.17,93.95 U4.7
  Route13 0.152: v85.24,95.44 85.24,87.82 v73.81,76.39
N$14  (via drill 0.35)
  Top 0.152: U3.30 77.26,78.92 76.91,78.56 73.44,78.56 v72.54,77.66 | U4.6 87.78,94.61 v87.78,95.44
  Route13 0.152: v87.78,95.44 86.51,96.71 85.65,96.71 83.36,94.42 83.36,88.48 v72.54,77.66
N$17  (via drill 0.35)
  Top 0.152: v80.16,92.9 78.92,94.14 J2.1
  Top 0.203: v75.08,89.09 76.14,88.03 R3.2
  Route3 0.152: v80.16,92.9 76.35,89.09 v75.08,89.09
N$18
  Top 0.254: U6.5 96.67,77.66 97.76,76.57 97.76,75.66 95.95,73.85 R4.2
N$19
  Top 0.152: U8.3 123.91,80.43 D1.A 124.61,77.66 124.86,77.41 D2.C 129.69,79.94 129.69,84.01 130.96,85.28 RELAY1.COIL-
N$20
  Top 0.305: U$3_SENSOR1.1 12.85,42.1 19.2,35.75 29.36,35.75 30.84,34.28 R33.2 C34.1 30.84,25.8 30.63,25.59 26.27,25.59 U13.1
N$22
  Top 0.406: U7.2 21.42,79.73 20.71,80.44 C17.1
  Top 0.813: CR1.1 14.78,77.75 14.78,78.11 17.11,80.44 20.71,80.44
  Top 1.016: FU1.2 38.07,89.09 16.66,89.09 14.12,86.55 CR1.1
N$23
  Top 0.203: R13.2 21.95,74.36 U7.5
N$24  (via drill 0.35)
  Top 0.203: v22.96,84.01 22.96,84.26 C18.1 | v23.01,77.66 23.48,78.13 U7.4
  Route3 0.203: v23.01,77.66 22.96,77.71 v22.96,84.01
N$25
  Top 0.203: C22.1 29.09,71.31 R14.1
N$26  (via drill 0.35)
  Top 0.203: U7.7 31.23,78.13 C20.1 33.17,76.19 v33.17,75.12 | R14.2 33.17,70.25 v33.17,70.04
  Route3 0.203: v33.17,70.04 v33.17,75.12
N$27
  Top 0.406: C21.2 23.62,83.56 23.62,81.83 U7.1
N$28  (via drill 0.6)
  Top 0.406: C21.1 29.69,85.28 | 29.69,85.28 29.88,85.28 L1.1 30.71,83.57 v30.71,79.8 | U7.9 29.01,80.02 29.08,80.02 29.69,80.64 29.69,85.28 | D9.2 20.63,66.86 v23.22,69.45
  Route3 0.406: v23.22,69.45 30.71,76.94 v30.71,79.8
N$29  (via drill 0.35)
  Top 0.203: U7.10 28.72,82.11 v28.09,82.74 | v40.79,72.58 R15.2
  Route3 0.203: v28.09,82.74 30.63,82.74 v40.79,72.58
N$30
  Top 0.203: U7.6 34.74,71.31 35.91,71.31 R16.1 R17.2
N$31
  Top 0.203: IC4.2 34.29,41.85 33.27,40.83 C28.1
N$32
  Top 0.305: IC4.8 37.7,45.39 38.65,44.43 | C26.1 38.65,44.43 | 38.65,44.43 38.65,42.1 C25.1
N$33
  Top 0.305: R18.2 44.65,43.11 C26.2
N$34  (via drill 0.35)
  Top 0.305: v37.58,46.29 39.24,46.29 C27.1 | IC4.10 34.83,46.18 34.83,46.66 35.14,46.97 v35.14,47.92
  Route3 0.305: v35.14,47.92 36.77,46.29 v37.58,46.29
N$35  (via drill 0.35)
  Top 0.305: IC4.5 36.04,41.87 v36.47,41.44 | R19.2 38.91,38.09 v38.91,40.63
  Route3 0.305: v36.47,41.44 38.1,41.44 v38.91,40.63
N$36
  Top 0.305: 30.7,45.39 29.43,45.39 29.93,44.89 IC4.14 | 30.7,45.39 IC4.13 | L2.2 30.7,45.39 | IC4.12 33.79,51.12 D10.2
  Top 1.016: L2.2 32.36,52.26 D10.2
N$37  (via drill 0.35)
  Top 0.305: IC4.9 38.15,49 R21.2 38.12,49.54 v36.77,49.54 | R20.1 45.4,47.82 45.4,45.99 v45.09,45.68
  Route3 0.305: v36.77,49.54 40.62,45.68 v45.09,45.68
N$38
  Top 0.203: R15.1 R22.2 37.44,61.81 JP4.1 | R15.1 45.66,67.3 TP2.TP | R15.1 41,67.3
N$39
  Top 0.152: R24.2 119.53,80 119.53,81.47 120.48,82.42 U8.1
N$40
  Top 0.152: U9.3 123.91,69 D3.A 124.61,66.23 124.86,65.97 D5.C 129.69,68.52 129.69,72.58 130.96,73.85 RELAY2.COIL-
N$41
  Top 0.152: R27.1 D5.A
N$42
  Top 0.152: R26.2 120.86,71.31 U9.1
N$43
  Top 0.152: U10.3 123.91,58.84 D6.A 124.61,56.07 124.86,55.81 D7.C 129.69,58.36 129.69,61.15 130.96,62.42 RELAY3.COIL-
N$44
  Top 0.152: R29.1 D7.A
N$45
  Top 0.152: R28.2 120.86,61.15 U10.1
N$46
  Top 0.152: U11.3 123.91,48.68 D8.A 124.61,45.91 124.86,45.66 D11.C 129.69,48.19 129.69,49.72 130.96,50.99 RELAY4.COIL-
N$47
  Top 0.152: R31.1 D11.A
N$48
  Top 0.152: R30.2 120.86,50.99 U11.1
N$49
  Top 0.2: IC3.5 46.84,15.14 48.03,13.95 48.03,12.73 48.41,12.35 48.41,11.62 49.68,10.35 58.57,10.35 59.52,11.3 U14.2
N$50
  Top 0.254: IC3.6 46.06,14.63 45.39,14.63 44.6,15.43 44.6,16.7 45.87,17.97 47.14,17.97 48.41,16.7 48.41,12.89 49.68,11.62 57.24,11.62 U14.1
N$51
  Top 0.305: R32.1 41.86,19.24 40.79,20.31 JP8.2
N$52
  Top 0.305: R32.2 53.49,15.64 53.49,14.16 53.17,13.84 IC3.2
N$53
  Top 1.016: U$1.2 15.39,92.9 FU1.1
N$54  (via drill 0.35)
  Top 0.152: J1.89 79.25,69.92 79.25,69.51 78.5,68.77 v73.81,68.77 | v94.13,57.34 91.59,57.34 v90.33,58.6
  Route3 0.152: v94.13,57.34 94.13,58.61 95.4,59.88 101.75,59.88 | v73.81,68.77 81.41,68.77 87.4,62.78 87.83,62.78 90.33,60.28 v90.33,58.6 | 101.75,59.88 101.88,59.88 | 101.75,59.88 118.26,43.37 125.88,43.37 127.15,42.1 127.15,38.29 125.88,37.02 JP10.1
N$55  (via drill 0.35)
  Top 0.152: J1.91 78.9,69.97 78.9,69.59 78.72,69.41 74.44,69.41 v74.03,69.82 | v92.86,59.88 94.13,59.88 v95.4,58.61
  Route3 0.152: v95.4,58.61 99.21,58.61 119.53,38.29 JP10.3 | v74.03,69.82 80.8,69.82 87.53,63.08 89.64,63.08 89.94,62.78 89.96,62.78 v92.86,59.88
N$56
  Top 0.305: R23.1 R42.2 C31.1 20.27,20.72 21.11,19.88 U13.2
N$57
  Top 0.254: C41.1 154.17,25.84 IC1.2
N$58
  Top 0.152: C39.1 158.38,22.1 | 158.38,22.1 IC1.8 | C38.1 160.17,16.7 158.38,18.49 158.38,22.1
N$59
  Top 0.152: R43.2 C39.2
N$60
  Top 0.152: C40.1 159.72,25.34 IC1.10
N$61  (via drill 0.35)
  Top 0.254: v156.36,23.05 156.88,23.57 IC1.5 | R44.2 157.63,15.23 v157.63,16.7
  Route3 0.254: v156.36,23.05 157.63,21.78 v157.63,16.7
N$62
  Top 0.254: IC1.14 157.88,27.62 L3.2 156.36,30.41 158.38,28.39 | IC1.13 158.38,28.39 | IC1.12 159.13,27.64 158.38,28.39
  Top 1.016: L3.2 153.56,30.41 150.71,27.56 150.67,27.55 150.62,27.55 150.01,26.94 CR2.2
N$63
  Top 0.152: IC1.9 161.98,24.84 R46.2 161.44,23.26 161.44,23.05 162.71,21.78 166.52,21.78 167.79,23.05 R45.1
NOCS1  (via drill 0.35)
  Top 0.152: U3.17 81.09,83.45 81.44,83.8 81.44,84 81.13,84.31 80.29,84.31 | 80.29,84.31 U3.19 | 80.29,84.31 79.19,84.31 78.84,83.96 78.83,83.96 78.52,83.65 78.52,83.45 78.88,83.1 U3.21 | U3.13 83.97,83.3 83.97,84.01 | 83.97,84.01 82.7,85.28 81.26,85.28 80.29,84.31 | v83.97,85.28 83.97,84.01
  Top 0.203: U6.4 96.35,76.71 v96.88,76.18
  Route3 0.152: v83.97,85.28 87.78,85.28 v96.88,76.18
PCIE_!RST  (via drill 0.5)
  Top 0.152: J4.9 95.32,36.94 95.4,37.02 110.64,37.02 114.45,33.21 v125.88,33.21 | J5.A11 142.39,16.76 v142.39,17.97
  Route3 0.152: v125.88,33.21 132.79,26.3 132.79,25.79 134.12,24.46 134.63,24.46 139.33,19.76 139.91,19.76 141.7,17.97 v142.39,17.97
PCIE_CLK_!REQ
  Top 0.152: J4.2 99.16,30.67 146.2,30.67 147.47,29.4 147.47,19.24 147.16,18.93 J5.B12
PCIE_CLK_N  (via drill 0.5)
  Top 0.152: J4.12 94.92,34 95.4,34.48 111.91,34.48 114.45,31.94 v124.61,31.94 | v136.04,21.78 138.71,21.78 J5.A14
  Route3 0.152: v124.61,31.94 134.77,21.78 v136.04,21.78
PCIE_CLK_P
  Top 0.152: J4.10 95.39,32.84 95.39,32.47 95.52,32.33 95.9,32.33 98.83,29.4 141.12,29.4 142.39,28.13 142.39,24.28 142.39,23.59 142.39,23.58 142.39,22.28 142.39,21.59 142.39,21.58 142.39,20.51 141.81,19.93 J5.A13
PCIE_RX_N
  Top 0.152: J5.A16 103.7,22.93 103,23.62 102.97,23.62 94.57,32.03 94.2,32.03 93.89,32.34 93.89,32.37 93.79,32.47 93.79,32.84 J4.18
PCIE_RX_P
  Top 0.152: J5.A17 103.1,23.93 94.7,32.33 94.33,32.33 94.19,32.47 94.19,32.84 J4.16
PCIE_TX_N
  Top 0.152: J4.24 92.59,32.84 92.59,32.47 92.69,32.37 92.69,32.34 93,32.03 93.34,32.03 93.95,31.42 93.98,31.42 111.54,13.86 111.58,13.86 112.54,12.89 138.73,12.89 138.73,12.59 139.22,12.1 139.91,12.1 140.39,12.59 140.39,12.89 145.23,12.89 145.23,12.59 145.72,12.1 146.41,12.1 146.89,12.59 146.89,12.89 148.74,12.89 150.01,14.16 150.01,15.43 148.74,16.7 146.2,16.7 144.93,17.97 144.93,19.8 J5.B14
PCIE_TX_P
  Top 0.152: J4.22 92.99,32.84 92.99,32.47 93.12,32.33 93.49,32.33 93.58,32.24 93.58,32.21 94.07,31.72 94.11,31.72 111.67,14.16 137.31,14.16 142.39,19.24 142.39,19.58 142.39,19.59 142.39,20.08 142.69,20.38 142.69,20.57 J5.B15
PI_LED_!PWR
  Top 0.152: J1.95 78.19,70.06 78.19,71.71 79.07,72.58 83.56,72.58 86.51,75.53 86.51,80.2 87.78,81.47 U1.2
PWR1  (via drill 0.35)
  Top 0.152: v85.24,84.01 85.24,83.87 U3.12
  Top 0.203: U6.3 92.66,76.39 v91.59,76.39
  Route3 0.152: v91.59,76.39 91.59,77.66 87.12,82.13 87.12,82.99 86.76,83.35 85.9,83.35 v85.24,84.01
RUN_PG
  Top 0.152: J1.92 78.92,63.72 77.62,62.42 | 77.62,62.42 57.3,62.42 56.67,61.78 56.67,60.41 56.97,60.1 57.35,60.1 U2.2 | 77.62,62.42 85.65,62.42 90.08,57.99 90.5,57.99 111.48,37.02 117.37,37.02 119.12,38.77 122.55,38.77 JP11.1
SCADA_OUT1
  Route3 0.406: RELAY3.OUT 153.65,54.8 U$3.1
SCADA_OUT2
  Top 0.406: U$3.3 159.77,62.93 158.52,61.67 158.52,54.08 RELAY4.OUT
SCL0  (via drill 0.35)
  Top 0.152: J1.80 81.39,66.84 81.39,65.41 82.45,64.35 83.31,64.35 v83.97,63.69 | J7.11 112.72,97.52 v113.18,97.98
  Route13 0.152: v113.18,97.98 113.18,93.35 91.75,71.92 91.34,71.92 90.98,71.56 90.98,70.7 v83.97,63.69
SCL1  (via drill 0.5)
  Top 0.254: R9.1 95.4,91.51 v95.34,91.57
  Route3 0.254: JP2.2 95.4,94.17 95.4,91.63 v95.34,91.57
SDA0  (via drill 0.35)
  Top 0.152: J1.82 80.85,66.98 80.85,67.36 80.7,67.5 v72.54,67.5 | v111.91,97.98 111.91,94.94 J7.12
  Route13 0.152: v111.91,97.98 108.96,97.98 108.35,97.37 102.54,97.37 100.89,95.72 100.63,95.72 99.49,94.58 99.49,93.59 85.52,79.62 85.07,79.62 74.42,68.97 74.42,68.52 74.06,68.16 73.2,68.16 v72.54,67.5
SDA1  (via drill 0.5)
  Top 0.254: R10.1 98.45,90.87 v99.21,91.63
  Route3 0.254: v99.21,91.63 99.21,95.44 JP2.4
SHDN/!CS_ADC
  Top 0.152: R40.2 30.2,13.53 U13.10
USBD_N  (via drill 0.35)
  Top 0.152: J2.2 78.27,92.9 79.54,91.63 80.16,91.63 82.7,94.17 83.54,94.17 83.84,94.47 84.66,94.47 | U4.8 85.24,94.17 84.96,94.17 84.66,94.47 | v82.7,95.44 83.69,95.44 84.66,94.47 | U5.4 86.51,88.53 v86.51,89.09
  Route3 0.152: v86.51,89.09 82.7,92.9 v82.7,95.44
USBD_P
  Top 0.152: J2.3 77.84,94.68 77.84,94.13 77.97,94.01 77.97,92.12 78.46,91.63 79.11,91.63 79.41,91.33 80.29,91.33 80.59,91.63 81.43,91.63 82.7,92.9 | 82.7,92.9 83.97,94.17 84.53,94.17 U4.9 | U5.5 84.83,89.5 82.7,91.63 82.7,92.9
USBOTG_ID  (via drill 0.35)
  Top 0.203: R5.2 81.22,87.82 R3.1 78.89,87.62 v78.89,85.28 | U4.2 88.91,89.64 89.42,89.14 89.42,88.72 v90.32,87.82
  Route3 0.203: v78.89,85.28 80.16,86.55 89.05,86.55 v90.32,87.82
VBUS  (via drill 0.6)
  Top 0.305: JP3.1 JP3.2 | C14.1 C13.1 C12.1 C11.1 108.3,77.66 100.73,77.66 99.97,76.9 | 99.97,76.9 97.94,78.93 95.59,78.93 95.5,78.83 | 99.21,75.63 98.95,75.38 99.72,75.38 C15.1 99.97,76.9
  Top 0.406: J3.1B J3.1A
  Top 0.61: U6.6 95.5,78.83 96.67,80 v96.67,80.2
  Route2 0.61: v96.67,80.2 96.67,85.28 90.32,91.63 71.27,91.63 | 71.27,91.63 68.7,94.2 J3.1B | J3.1A 61.11,91.27 61.11,87.82 62.38,86.55 66.19,86.55 71.27,91.63
  Bottom 0.152: J3.1A 60.8,65.27 63.65,62.42 63.65,58.61 61.11,56.07 49.68,56.07 21.74,28.13 21.74,18.79 16.36,13.41 16.36,12.11 15.2,10.96 13.87,10.96 13.51,10.6 13.51,9.74 JP3.2
VDAC_COMP
  Top 0.152: JP6.11 57.99,39.28 57.99,37.88 58.84,37.02 73.81,37.02 76.35,39.56 92.86,39.56 94.92,37.5 J4.11

## Text on the board
SilkscreenTop: BMS | +24-48 | RET EV / Current measurement device / Version: 1.0.3 / Date : dec 2024 | 2 | sma conector | +5V | GND | GND | 1 | + | - | VIN / status | SCADA | 2 | +24V | GND | 1 | + | - | GND | +24V | - | + | -VOUT | +VOUT